# EAGLE design AUVfirstdraft3 (EAGLE 9.1.2)
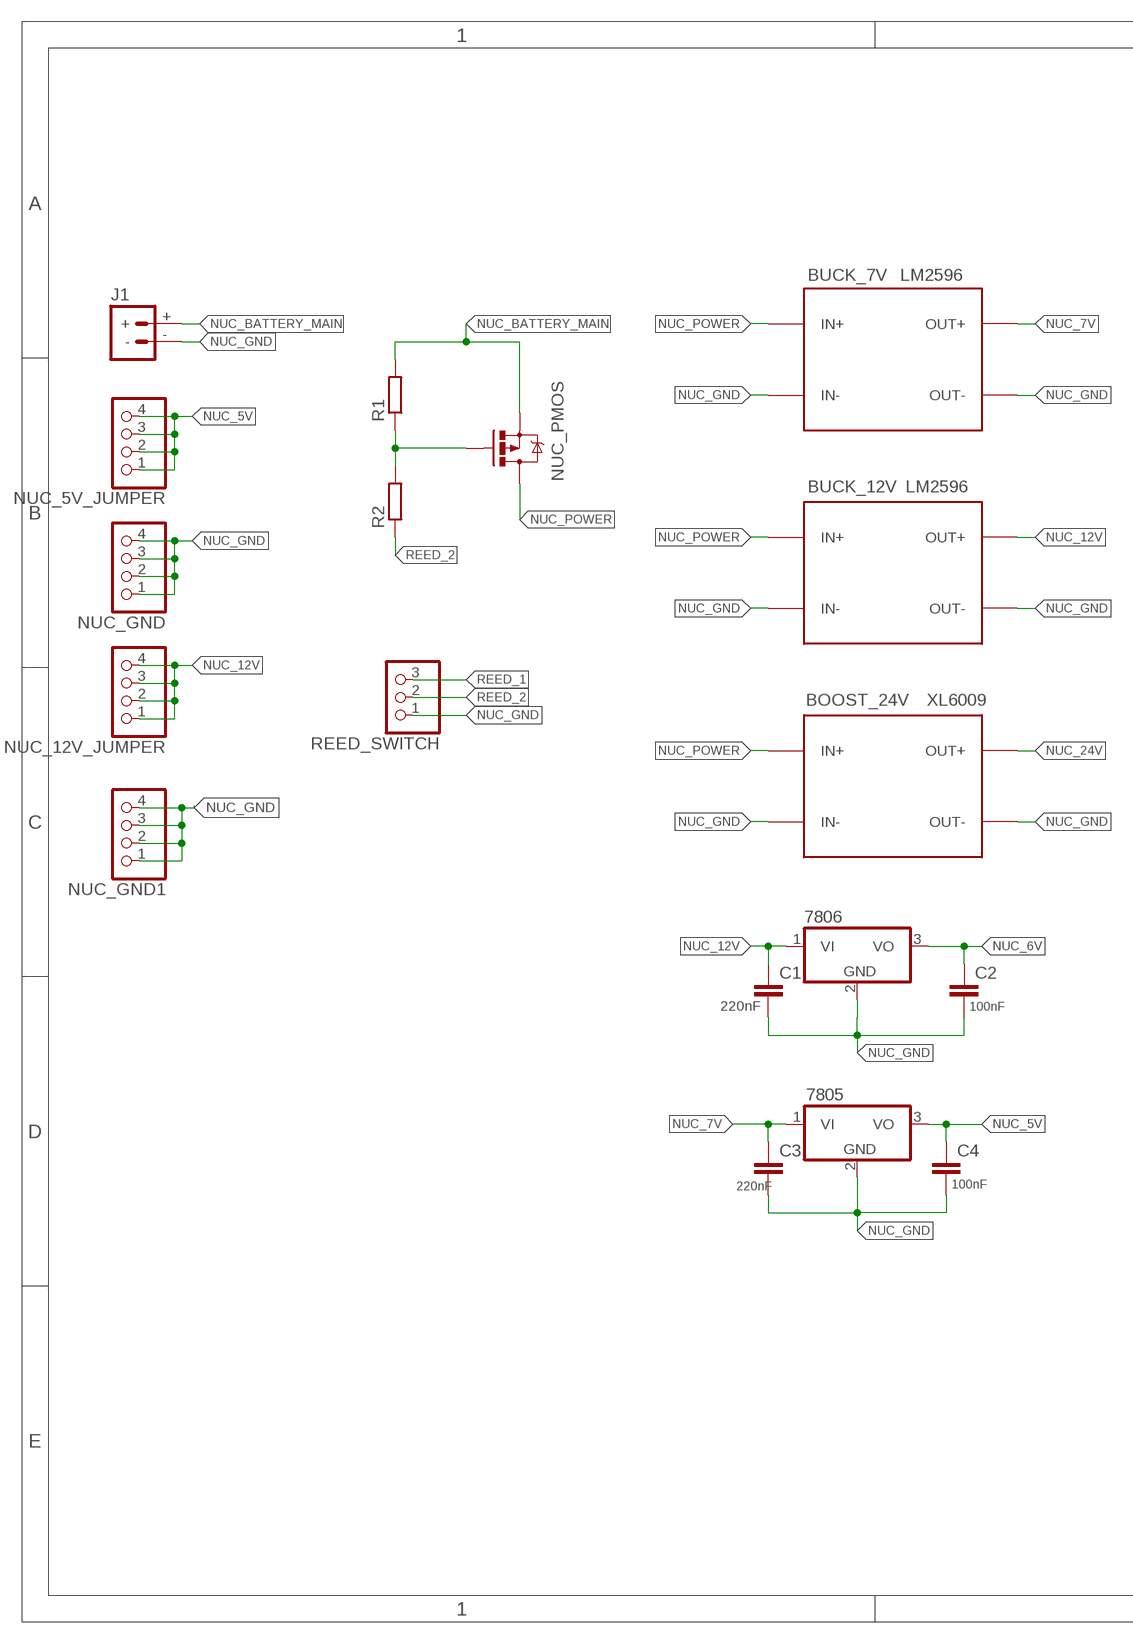
[diagram p0: schematic, sheet 1, part 1 of 3]
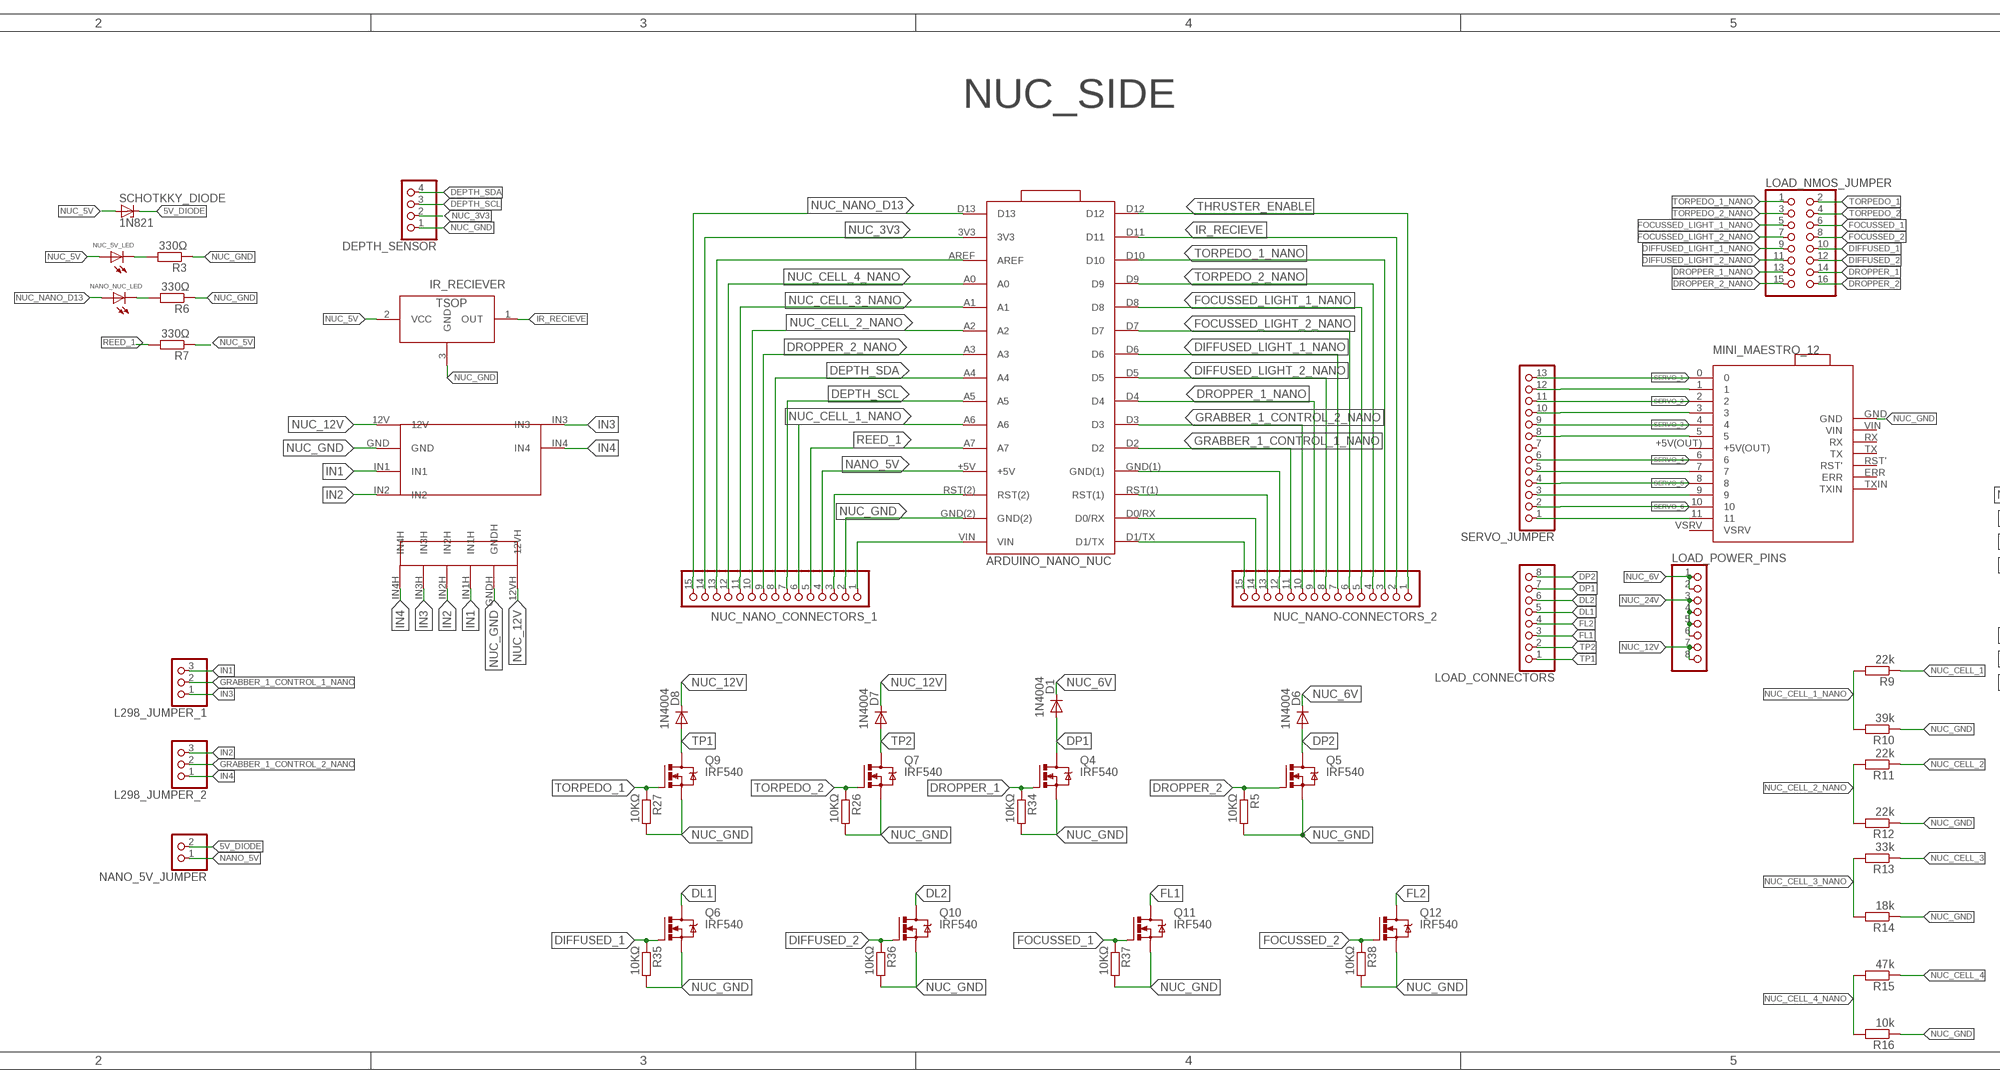
[diagram p1: schematic, sheet 1, part 2 of 3]
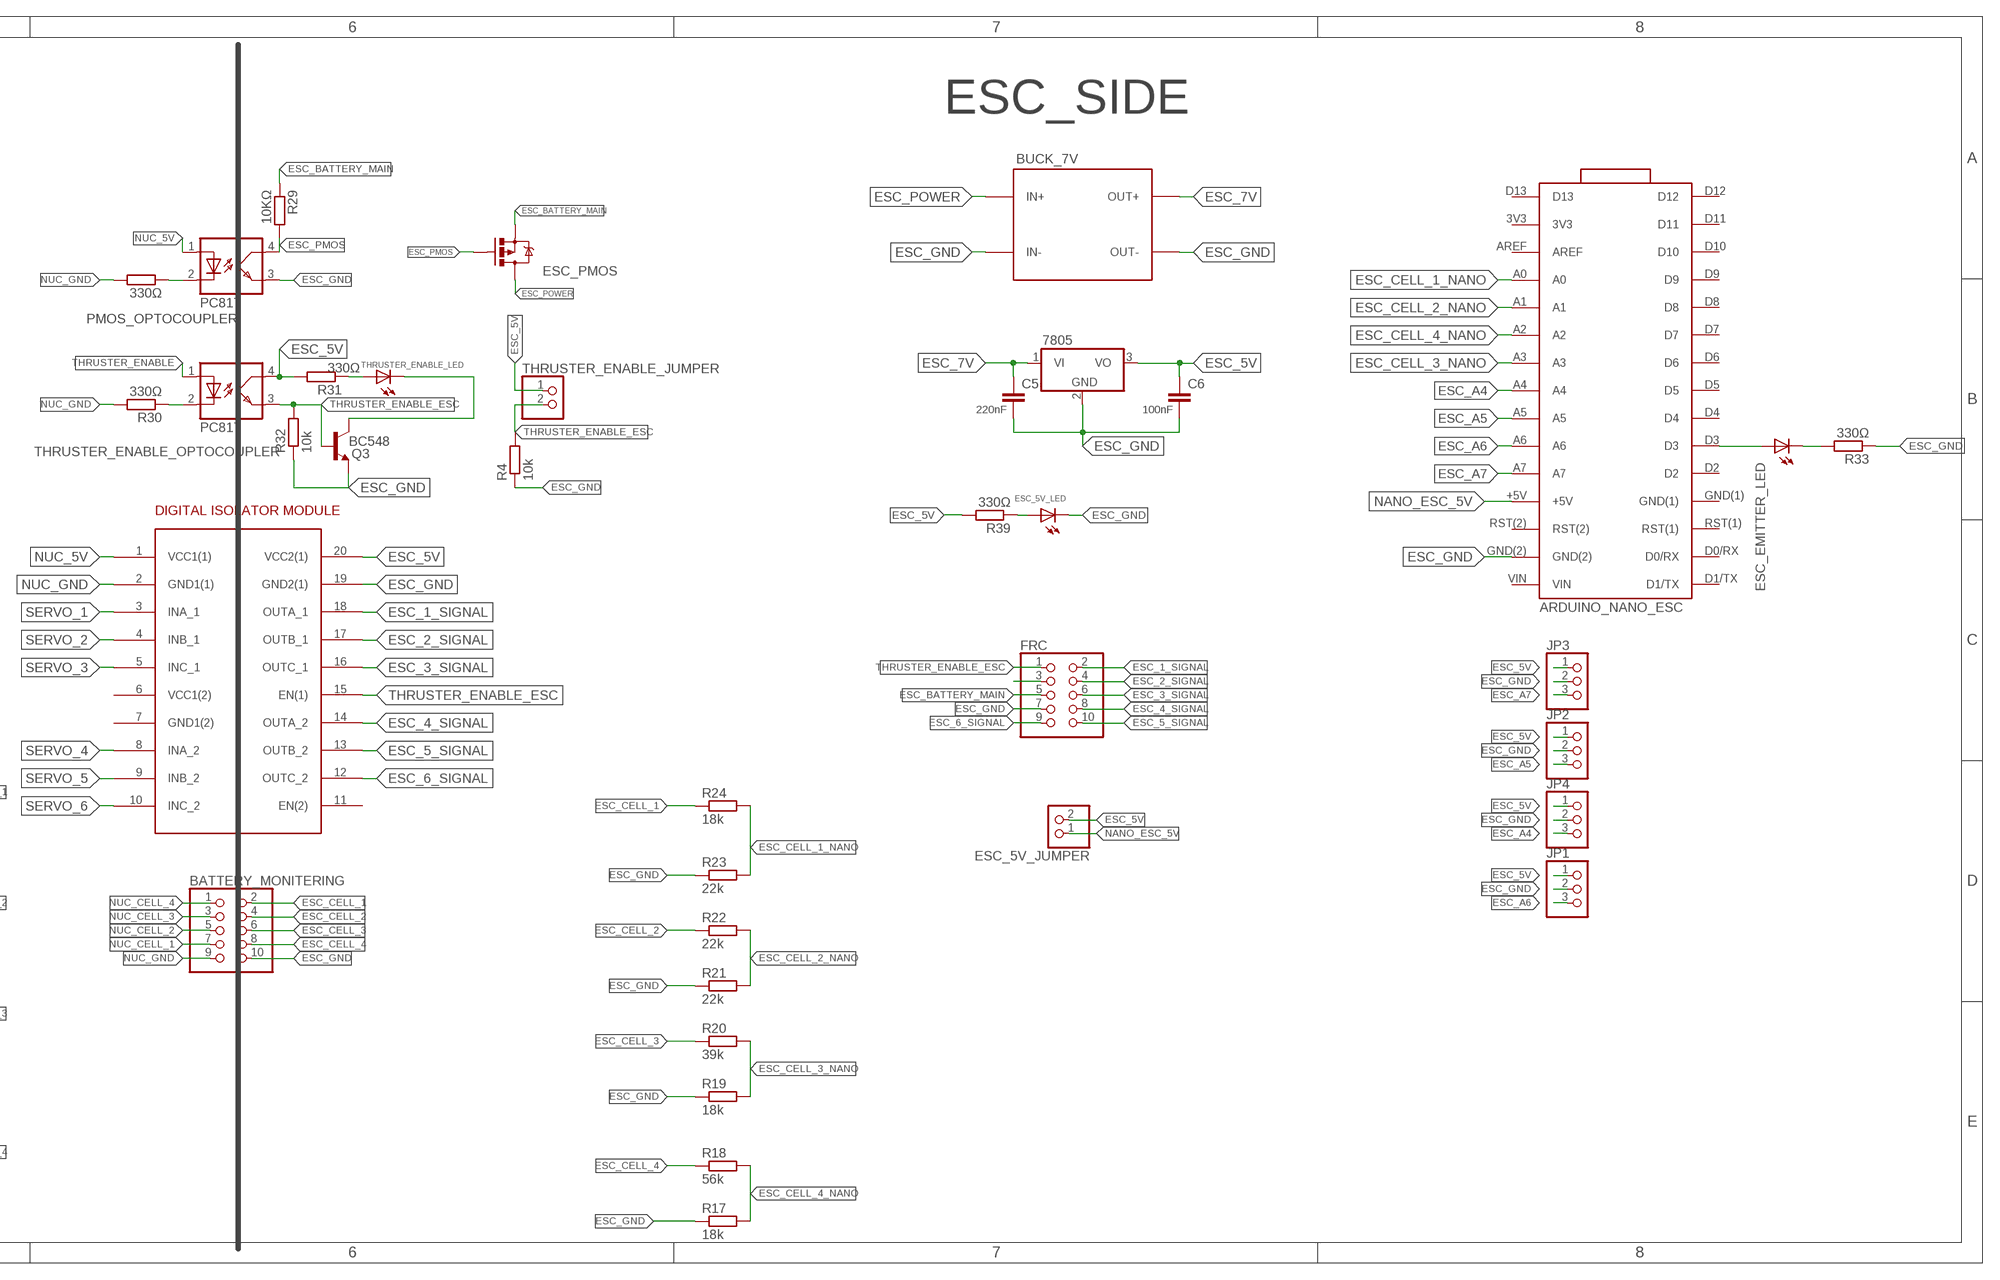
[diagram p2: schematic, sheet 1, part 3 of 3]

## Parts
330Ω  R-EU_0204/7  [0204/7]
7805_ESC  7805TV  [TO220V]
7805_NUC  7805TV  [TO220V]
7806_NUC  7805TV  [TO220V]
BATTERY_MONITERING  PINHD-2X5  [2X05]
BOOST_24V_NUC  DC-DC-STEP-DOWN-LM2596  [DC-DC-STEP-DOWN-LM2596]
BUCK_7V_ESC  DC-DC-STEP-DOWN-LM2596  [DC-DC-STEP-DOWN-LM2596]
BUCK_7V_NUC  DC-DC-STEP-DOWN-LM2596  [DC-DC-STEP-DOWN-LM2596]
BUCK_12_NUC  DC-DC-STEP-DOWN-LM2596  [DC-DC-STEP-DOWN-LM2596]
C1  220nF  C-EU025-024X044  [C025-024X044]
C2  100nF  C-EU025-024X044  [C025-024X044]
C3  220nF  C-EU025-024X044  [C025-024X044]
C4  100nF  C-EU025-024X044  [C025-024X044]
C5  220nF  C-EU025-024X044  [C025-024X044]
C6  100nF  C-EU025-024X044  [C025-024X044]
D1  1N4004  [DO41-10]
D6  1N4004  [DO41-10]
D7  1N4004  [DO41-10]
D8  1N4004  [DO41-10]
DEPTH_SENSOR  PINHD-1X4  [1X04]
ESC_5V_JUMPER  PINHD-1X2  [1X02]
ESC_5V_LED  LED3MM  [LED3MM]
ESC_EMITTER_LED  LED5MM  [LED5MM]
ESC_PMOS  MOSFET-PCHANNELFQP27P06  [TO220V]
FRC  PINHD-2X5  [2X05]
IR_RECIEVER  TSOP34X  [TSOP3XXX]
ISOLATION_CIRCUIT  DIGITAL_ISOLATOR  [DIGITAL_ISOLATOR_MODULE]
J1  BATTERY_CONN_DEANS  [DEANS]
JP1  PINHD-1X3  [1X03]
JP2  PINHD-1X3  [1X03]
JP3  PINHD-1X3  [1X03]
JP4  PINHD-1X3  [1X03]
L298_JUMPER_1  PINHD-1X3  [1X03]
L298_JUMPER_2  PINHD-1X3  [1X03]
L298_MOTOR_DRIVER  L298MODULE  [L298MODULE]
LOAD_CONNECTORS  PINHD-1X8  [1X08]
LOAD_NMOS_JUMPER  PINHD-2X8  [2X08]
LOAD_POWER_PINS  PINHD-1X8  [1X08]
NANO_5V_JUMPER  PINHD-1X2  [1X02]
NANO_NUC_LED  LED3MM  [LED3MM]
NUC_5V_JUMPER  PINHD-1X4  [1X04]
NUC_5V_LED  LED3MM  [LED3MM]
NUC_12V_JUMPER  PINHD-1X4  [1X04]
NUC_GND  PINHD-1X4  [1X04]
NUC_GND1  PINHD-1X4  [1X04]
NUC_NANO-CONNECTORS_2  PINHD-1X15  [1X15]
NUC_NANO_CONNECTORS_1  PINHD-1X15  [1X15]
NUC_PMOS  MOSFET-PCHANNELFQP27P06  [TO220V]
PMOS_OPTOCOUPLER  PC817  [DIL04]
Q3  BC548  [TO92-EBC]
Q4  IRF540  [TO220BV]
Q5  IRF540  [TO220BV]
Q6  IRF540  [TO220BV]
Q7  IRF540  [TO220BV]
Q9  IRF540  [TO220BV]
Q10  IRF540  [TO220BV]
Q11  IRF540  [TO220BV]
Q12  IRF540  [TO220BV]
R1  R-EU_0204/7  [0204/7]
R2  R-EU_0204/7  [0204/7]
R3  330Ω  R-EU_0204/7  [0204/7]
R4  10k  R-EU_0204/7  [0204/7]
R5  10KΩ  R-EU_0204/7  [0204/7]
R6  330Ω  R-EU_0204/7  [0204/7]
R7  330Ω  R-EU_0204/7  [0204/7]
R9  22k  R-EU_0204/7  [0204/7]
R10  39k  R-EU_0204/7  [0204/7]
R11  22k  R-EU_0204/7  [0204/7]
R12  22k  R-EU_0204/7  [0204/7]
R13  33k  R-EU_0204/7  [0204/7]
R14  18k  R-EU_0204/7  [0204/7]
R15  47k  R-EU_0204/7  [0204/7]
R16  10k  R-EU_0204/7  [0204/7]
R17  18k  R-EU_0204/7  [0204/7]
R18  56k  R-EU_0204/7  [0204/7]
R19  18k  R-EU_0204/7  [0204/7]
R20  39k  R-EU_0204/7  [0204/7]
R21  22k  R-EU_0204/7  [0204/7]
R22  22k  R-EU_0204/7  [0204/7]
R23  22k  R-EU_0204/7  [0204/7]
R24  18k  R-EU_0204/7  [0204/7]
R26  10KΩ  R-EU_0204/7  [0204/7]
R27  10KΩ  R-EU_0204/7  [0204/7]
R29  10KΩ  R-EU_0204/7  [0204/7]
R30  330Ω  R-EU_0204/7  [0204/7]
R31  330Ω  R-EU_0204/7  [0204/7]
R32  10k  R-EU_0204/7  [0204/7]
R33  330Ω  R-EU_0204/7  [0204/7]
R34  10KΩ  R-EU_0204/7  [0204/7]
R35  10KΩ  R-EU_0204/7  [0204/7]
R36  10KΩ  R-EU_0204/7  [0204/7]
R37  10KΩ  R-EU_0204/7  [0204/7]
R38  10KΩ  R-EU_0204/7  [0204/7]
R39  330Ω  R-EU_0204/7  [0204/7]
REED_SWITCH  PINHD-1X3  [1X03]
SCHOTKKY_DIODE  1N821  [DO35Z10]
SERVO_JUMPER  PINHD-1X13  [1X13]
THRUSTER_ENABLE_JUMPER  PINHD-1X2  [1X02]
THRUSTER_ENABLE_LED  LED3MM  [LED3MM]
THRUSTER_ENABLE_OPTOCOUPLER  PC817  [DIL04]
U$1  ARDUINO(NANO_3.0)  [ARDUINO_NANO_30PIN]
U$4  SERVO_CONTROLLER  [SERVO_CONTROLLER]
U$6  ARDUINO(NANO_3.0)  [ARDUINO_NANO_30PIN]

## Nets
5V_DIODE: NANO_5V_JUMPER.2 SCHOTKKY_DIODE.C
DEPTH_SCL: DEPTH_SENSOR.3 NUC_NANO_CONNECTORS_1.7 U$1.A5
DEPTH_SDA: DEPTH_SENSOR.4 NUC_NANO_CONNECTORS_1.8 U$1.A4
DIFFUSED_1: LOAD_NMOS_JUMPER.10 Q6.G R35.1
DIFFUSED_2: LOAD_NMOS_JUMPER.12 Q10.G R36.1
DIFFUSED_LIGHT_1_NANO: LOAD_NMOS_JUMPER.9 NUC_NANO-CONNECTORS_2.7 U$1.D6
DIFFUSED_LIGHT_2_NANO: LOAD_NMOS_JUMPER.11 NUC_NANO-CONNECTORS_2.8 U$1.D5
DL1: LOAD_CONNECTORS.5 Q6.D
DL2: LOAD_CONNECTORS.6 Q10.D
DP1: D1.A LOAD_CONNECTORS.7 Q4.D
DP2: D6.A LOAD_CONNECTORS.8 Q5.D
DROPPER_1: LOAD_NMOS_JUMPER.14 Q4.G R34.1
DROPPER_1_NANO: LOAD_NMOS_JUMPER.13 NUC_NANO-CONNECTORS_2.9 U$1.D4
DROPPER_2: LOAD_NMOS_JUMPER.16 Q5.G R5.1
DROPPER_2_NANO: LOAD_NMOS_JUMPER.15 NUC_NANO_CONNECTORS_1.9 U$1.A3
ESC_1_SIGNAL: FRC.2 ISOLATION_CIRCUIT.18(OUTA_1)
ESC_2_SIGNAL: FRC.4 ISOLATION_CIRCUIT.17(OUTB_1)
ESC_3_SIGNAL: FRC.6 ISOLATION_CIRCUIT.16(OUTC_1)
ESC_4_SIGNAL: FRC.8 ISOLATION_CIRCUIT.14(OUTA_2)
ESC_5_SIGNAL: FRC.10 ISOLATION_CIRCUIT.13(OUTB_2)
ESC_5V: 7805_ESC.3(VO) C6.1 ESC_5V_JUMPER.2 ISOLATION_CIRCUIT.20(VCC2(1)) JP1.1 JP2.1 JP3.1 JP4.1 R31.2 R39.2 THRUSTER_ENABLE_JUMPER.1 THRUSTER_ENABLE_OPTOCOUPLER.4(COL)
ESC_6_SIGNAL: FRC.9 ISOLATION_CIRCUIT.12(OUTC_2)
ESC_7V: 7805_ESC.1(VI) BUCK_7V_ESC.OUT+ C5.1
ESC_A4: JP4.3 U$6.A4
ESC_A5: JP2.3 U$6.A5
ESC_A6: JP1.3 U$6.A6
ESC_A7: JP3.3 U$6.A7
ESC_BATTERY_MAIN: ESC_PMOS.3(S) FRC.5 R29.1
ESC_CELL_1: BATTERY_MONITERING.2 R24.1
ESC_CELL_1_NANO: R23.2 R24.2 U$6.A0
ESC_CELL_2: BATTERY_MONITERING.4 R22.1
ESC_CELL_2_NANO: R21.2 R22.2 U$6.A1
ESC_CELL_3: BATTERY_MONITERING.6 R20.1
ESC_CELL_3_NANO: R19.2 R20.2 U$6.A3
ESC_CELL_4: BATTERY_MONITERING.8 R18.1
ESC_CELL_4_NANO: R17.2 R18.2 U$6.A2
ESC_GND: 7805_ESC.2(GND) BATTERY_MONITERING.10 BUCK_7V_ESC.IN- BUCK_7V_ESC.OUT- C5.2 C6.2 ESC_5V_LED.K(C) FRC.7 ISOLATION_CIRCUIT.19(GND2(1)) JP1.2 JP2.2 JP3.2 JP4.2 PMOS_OPTOCOUPLER.3(EMIT) Q3.E R4.1 R17.1 R19.1 R21.1 R23.1 R32.1 R33.1 U$6.GND(2)
ESC_PMOS: ESC_PMOS.1(G) PMOS_OPTOCOUPLER.4(COL) R29.2
ESC_POWER: BUCK_7V_ESC.IN+ ESC_PMOS.2(D)
FL1: LOAD_CONNECTORS.3 Q11.D
FL2: LOAD_CONNECTORS.4 Q12.D
FOCUSSED_1: LOAD_NMOS_JUMPER.6 Q11.G R37.1
FOCUSSED_2: LOAD_NMOS_JUMPER.8 Q12.G R38.1
FOCUSSED_LIGHT_1_NANO: LOAD_NMOS_JUMPER.5 NUC_NANO-CONNECTORS_2.5 U$1.D8
FOCUSSED_LIGHT_2_NANO: LOAD_NMOS_JUMPER.7 NUC_NANO-CONNECTORS_2.6 U$1.D7
GRABBER_1_CONTROL_1_NANO: L298_JUMPER_1.2 NUC_NANO-CONNECTORS_2.11 U$1.D2
GRABBER_1_CONTROL_2_NANO: L298_JUMPER_2.2 NUC_NANO-CONNECTORS_2.10 U$1.D3
IN1: L298_JUMPER_1.3 L298_MOTOR_DRIVER.IN1 L298_MOTOR_DRIVER.IN1H
IN2: L298_JUMPER_2.3 L298_MOTOR_DRIVER.IN2 L298_MOTOR_DRIVER.IN2H
IN3: L298_JUMPER_1.1 L298_MOTOR_DRIVER.IN3 L298_MOTOR_DRIVER.IN3H
IN4: L298_JUMPER_2.1 L298_MOTOR_DRIVER.IN4 L298_MOTOR_DRIVER.IN4H
IR_RECIEVE: IR_RECIEVER.1(OUT) NUC_NANO-CONNECTORS_2.2 U$1.D11
N$1: NUC_NANO_CONNECTORS_1.1 U$1.VIN
N$2: NANO_NUC_LED.K(C) R6.2
N$4: R31.1 THRUSTER_ENABLE_LED.A
N$5: ESC_5V_LED.A R39.1
N$6: SERVO_JUMPER.12 U$4.1
N$7: NUC_NANO_CONNECTORS_1.3 U$1.RST(2)
N$8: 330Ω.1 PMOS_OPTOCOUPLER.2(C)
N$9: SERVO_JUMPER.10 U$4.3
N$10: ESC_EMITTER_LED.A U$6.D3
N$11: SERVO_JUMPER.8 U$4.5
N$12: FRC.3
N$13: SERVO_JUMPER.5 U$4.7
N$14: R30.1 THRUSTER_ENABLE_OPTOCOUPLER.2(C)
N$15: SERVO_JUMPER.3 U$4.9
N$16: Q3.C THRUSTER_ENABLE_LED.K(C)
N$17: NUC_NANO_CONNECTORS_1.13 U$1.AREF
N$18: ESC_EMITTER_LED.K(C) R33.2
N$19: SERVO_JUMPER.1 U$4.11
N$20: NUC_NANO-CONNECTORS_2.15 U$1.D1/TX
N$21: NUC_NANO-CONNECTORS_2.14 U$1.D0/RX
N$22: NUC_NANO-CONNECTORS_2.13 U$1.RST(1)
N$23: NUC_NANO-CONNECTORS_2.12 U$1.GND(1)
N$34: NUC_PMOS.1(G) R1.1 R2.2
N$38: NUC_5V_LED.K(C) R3.2
NANO_5V: NANO_5V_JUMPER.1 NUC_NANO_CONNECTORS_1.4 U$1.+5V
NANO_ESC_5V: ESC_5V_JUMPER.1 U$6.+5V
NUC_3V3: DEPTH_SENSOR.2 NUC_NANO_CONNECTORS_1.14 U$1.3V3
NUC_5V: 7805_NUC.3(VO) C4.1 IR_RECIEVER.2(VCC) ISOLATION_CIRCUIT.1(VCC1(1)) NUC_5V_JUMPER.1 NUC_5V_JUMPER.2 NUC_5V_JUMPER.3 NUC_5V_JUMPER.4 NUC_5V_LED.A PMOS_OPTOCOUPLER.1(A) R7.1 SCHOTKKY_DIODE.A
NUC_6V: 7806_NUC.3(VO) C2.1 D1.C D6.C LOAD_POWER_PINS.1 LOAD_POWER_PINS.2
NUC_7V: 7805_NUC.1(VI) BUCK_7V_NUC.OUT+ C3.1
NUC_12V: 7806_NUC.1(VI) BUCK_12_NUC.OUT+ C1.1 D7.C D8.C L298_MOTOR_DRIVER.12V L298_MOTOR_DRIVER.12VH LOAD_POWER_PINS.7 LOAD_POWER_PINS.8 NUC_12V_JUMPER.1 NUC_12V_JUMPER.2 NUC_12V_JUMPER.3 NUC_12V_JUMPER.4
NUC_24V: BOOST_24V_NUC.OUT+ LOAD_POWER_PINS.3 LOAD_POWER_PINS.4 LOAD_POWER_PINS.5 LOAD_POWER_PINS.6
NUC_BATTERY_MAIN: J1.+ NUC_PMOS.3(S) R1.2
NUC_CELL_1: BATTERY_MONITERING.7 R9.1
NUC_CELL_1_NANO: NUC_NANO_CONNECTORS_1.6 R9.2 R10.2 U$1.A6
NUC_CELL_2: BATTERY_MONITERING.5 R11.1
NUC_CELL_2_NANO: NUC_NANO_CONNECTORS_1.10 R11.2 R12.2 U$1.A2
NUC_CELL_3: BATTERY_MONITERING.3 R13.1
NUC_CELL_3_NANO: NUC_NANO_CONNECTORS_1.11 R13.2 R14.2 U$1.A1
NUC_CELL_4: BATTERY_MONITERING.1 R15.1
NUC_CELL_4_NANO: NUC_NANO_CONNECTORS_1.12 R15.2 R16.2 U$1.A0
NUC_GND: 330Ω.2 7805_NUC.2(GND) 7806_NUC.2(GND) BATTERY_MONITERING.9 BOOST_24V_NUC.IN- BOOST_24V_NUC.OUT- BUCK_7V_NUC.IN- BUCK_7V_NUC.OUT- BUCK_12_NUC.IN- BUCK_12_NUC.OUT- C1.2 C2.2 C3.2 C4.2 DEPTH_SENSOR.1 IR_RECIEVER.3(GND) ISOLATION_CIRCUIT.2(GND1(1)) J1.- L298_MOTOR_DRIVER.GND L298_MOTOR_DRIVER.GNDH NUC_GND1.1 NUC_GND1.2 NUC_GND1.3 NUC_GND1.4 NUC_GND.1 NUC_GND.2 NUC_GND.3 NUC_GND.4 NUC_NANO_CONNECTORS_1.2 Q4.S Q5.S Q6.S Q7.S Q9.S Q10.S Q11.S Q12.S R3.1 R5.2 R6.1 R10.1 R12.1 R14.1 R16.1 R26.2 R27.2 R30.2 R34.2 R35.2 R36.2 R37.2 R38.2 REED_SWITCH.1 U$1.GND(2) U$4.GND
NUC_NANO_D13: NANO_NUC_LED.A NUC_NANO_CONNECTORS_1.15 U$1.D13
NUC_POWER: BOOST_24V_NUC.IN+ BUCK_7V_NUC.IN+ BUCK_12_NUC.IN+ NUC_PMOS.2(D)
REED_1: NUC_NANO_CONNECTORS_1.5 R7.2 REED_SWITCH.3 U$1.A7
REED_2: R2.1 REED_SWITCH.2
SERVO_1: ISOLATION_CIRCUIT.3(INA_1) SERVO_JUMPER.13 U$4.0
SERVO_2: ISOLATION_CIRCUIT.4(INB_1) SERVO_JUMPER.11 U$4.2
SERVO_3: ISOLATION_CIRCUIT.5(INC_1) SERVO_JUMPER.9 U$4.4
SERVO_4: ISOLATION_CIRCUIT.8(INA_2) SERVO_JUMPER.6 U$4.6
SERVO_5: ISOLATION_CIRCUIT.9(INB_2) SERVO_JUMPER.4 U$4.8
SERVO_6: ISOLATION_CIRCUIT.10(INC_2) SERVO_JUMPER.2 U$4.10
THRUSTER_ENABLE: NUC_NANO-CONNECTORS_2.1 THRUSTER_ENABLE_OPTOCOUPLER.1(A) U$1.D12
THRUSTER_ENABLE_ESC: FRC.1 ISOLATION_CIRCUIT.15(EN(1)) Q3.B R4.2 R32.2 THRUSTER_ENABLE_JUMPER.2 THRUSTER_ENABLE_OPTOCOUPLER.3(EMIT)
TORPEDO_1: LOAD_NMOS_JUMPER.2 Q9.G R27.1
TORPEDO_1_NANO: LOAD_NMOS_JUMPER.1 NUC_NANO-CONNECTORS_2.3 U$1.D10
TORPEDO_2: LOAD_NMOS_JUMPER.4 Q7.G R26.1
TORPEDO_2_NANO: LOAD_NMOS_JUMPER.3 NUC_NANO-CONNECTORS_2.4 U$1.D9
TP1: D8.A LOAD_CONNECTORS.1 Q9.D
TP2: D7.A LOAD_CONNECTORS.2 Q7.D
Unconnected: ISOLATION_CIRCUIT.6(VCC1(2)) ISOLATION_CIRCUIT.7(GND1(2)) ISOLATION_CIRCUIT.11(EN(2)) SERVO_JUMPER.7 U$4.+5V(OUT) U$4.ERR U$4.RST' U$4.RX U$4.TX U$4.TXIN U$4.VIN U$4.VSRV U$6.3V3 U$6.AREF U$6.D0/RX U$6.D1/TX U$6.D2 U$6.D4 U$6.D5 U$6.D6 U$6.D7 U$6.D8 U$6.D9 U$6.D10 U$6.D11 U$6.D12 U$6.D13 U$6.GND(1) U$6.RST(1) U$6.RST(2) U$6.VIN

## Notes on the sheet
- NUC_SIDE | ESC_SIDE
- BUCK_7V
- BUCK_7V | LM2596
- 7805
- BUCK_12V | LM2596
- MINI_MAESTRO_12
- BOOST_24V | XL6009
- ARDUINO_NANO_ESC
- ARDUINO_NANO_NUC
- 7806
- 7805

## Library data of the parts
330Ω R1-R7 R9-R24 R26 R27 R29-R39 = resistor:R-EU_: RESISTOR, European symbol
7805_ESC 7805_NUC 7806_NUC = linear:78*: Positive VOLTAGE REGULATOR Source: http://cache.national.com/ds/LM/LM78L05.pdf http://www.fairchildsemi.com/ds/LM/LM7805.pdf
BATTERY_MONITERING FRC = pinhead:PINHD-2X5: PIN HEADER
BOOST_24V_NUC BUCK_7V_ESC BUCK_7V_NUC BUCK_12_NUC = diy-modules:DC-DC-STEP-DOWN-LM2596: DC/DC Step-Down Regulator based on LM2596-ADJ chip LM2596 datasheet available here: http://www.ti.com/lit/ds/symlink/lm2596.pdf Click here to find device on ebay.com <http://www.ebay.com/sch/lm2596+power+regulator>
C1-C6 = rcl:C-EU: CAPACITOR, European symbol
D1 D6-D8 = adafruit:1N4004: DIODE General purpose 1N400x type rectifier (With bigger pads) http://www.ladyada.net/library/pcb/eaglelibrary.html
DEPTH_SENSOR NUC_5V_JUMPER NUC_12V_JUMPER NUC_GND NUC_GND1 = pinhead:PINHD-1X4: PIN HEADER
ESC_5V_JUMPER NANO_5V_JUMPER THRUSTER_ENABLE_JUMPER = pinhead:PINHD-1X2: PIN HEADER
ESC_5V_LED ESC_EMITTER_LED NANO_NUC_LED NUC_5V_LED THRUSTER_ENABLE_LED = adafruit:LED: LED OSRAM: - CHIPLED LG R971, LG N971, LY N971, LG Q971, LY Q971, LO R971, LY R971 LH N974, LH R974 LS Q976, LO Q976, LY Q976 LO Q996 - Hyper CHIPLED LW Q18S LB Q993, LB Q99A, LB R99A - SideLED LS A670, LO A670, LY A670, LG A670, LP A670 LB A673, LV A673, LT A673, LW A673 LH A674 LY A675 LS A676, LA A676, LO A676, LY A676, LW A676 LS A679, LY A679, LG A679 - Hyper Micro SIDELED® LS Y876, LA Y876, LO Y876, LY Y876 LT Y87S - SmartLED LW L88C, LW L88S LB L89C, LB L89S, LG L890 LS L89K, LO L89K, LY L89K LS L896, LA L896, LO L896, LY L896 - TOPLED LS T670, LO T670, LY T670, LG T670, LP T670 LSG T670, LSP T670, LSY T670, LOP T670, LYG T670 LG T671, LOG T671, LSG T671 LB T673, LV T673, LT T673, LW T673 LH T674 LS T676, LA T676, LO T676, LY T676, LB T676, LH T676, LSB T676, LW T676 LB T67C, LV T67C, LT T67C, LS T67K, LO T67K, LY T67K, LW E67C LS E67B, LA E67B, LO E67B, LY E67B, LB E67C, LV E67C, LT E67C LW T67C LS T679, LY T679, LG T679 LS T770, LO T770, LY T770, LG T770, LP T770 LB T773, LV T773, LT T773, LW T773 LH T774 LS E675, LA E675, LY E675, LS T675 LS T776, LA T776, LO T776, LY T776, LB T776 LHGB T686 LT T68C, LB T68C - Hyper Mini TOPLED® LB M676 - Mini TOPLED Santana® LG M470 LS M47K, LO M47K, LY M47K Source: http://www.osram.convergy.de/
ESC_PMOS NUC_PMOS = SparkFun-DiscreteSemi:MOSFET-PCHANNEL: Generic PMOSFET IRLML2244 - TRANS-11153 (SOT-23 -20V -4.3A) (1.Gate 2.Source 3.Drain) FQP27P06 - COM-10349 <http://www.sparkfun.com/products/10349> (TO-220 -60V -27A) (1.Gate 2.Source 3.Drain)
IR_RECIEVER = CEDT_JANUARY_2015_v5:TSOP34X: Vishay IR Reciever Product Page <http://www.vishay.com/product?docid=82489> Family -TSOP34XX Part by : Rohit Gupta
ISOLATION_CIRCUIT = ISO7330C DIGITAL ISOLATOR MODULE:DIGITAL_ISOLATOR
J1 = SparkFun-Connectors:BATTERY_CONN: Battery Connectors Various footprints for battery connections SparkFun Products: Deans Connector -M/F Pair <https://www.sparkfun.com/products/11864>; SF_ID: PRT-11864
JP1-JP4 L298_JUMPER_1 L298_JUMPER_2 REED_SWITCH = pinhead:PINHD-1X3: PIN HEADER
L298_MOTOR_DRIVER = l298module:L298MODULE
LOAD_CONNECTORS LOAD_POWER_PINS = pinhead:PINHD-1X8: PIN HEADER
LOAD_NMOS_JUMPER = pinhead:PINHD-2X8: PIN HEADER
NUC_NANO-CONNECTORS_2 NUC_NANO_CONNECTORS_1 = pinhead:PINHD-1X15: PIN HEADER
PMOS_OPTOCOUPLER THRUSTER_ENABLE_OPTOCOUPLER = optocoupler:PC817: SHARP OPTO COUPLER; MPN: PC817X4J000F; OC_FARNELL: 9707727; OC_NEWARK: 97K7059
Q3 = transistor-npn:BC548*: NPN Transistor
Q4-Q7 Q9-Q12 = transistor-power:IRF540: HEXFET Power MOSFET
SCHOTKKY_DIODE = diode:1N821: Reference DIODE temperature compensated, 6,2 V
SERVO_JUMPER = pinhead:PINHD-1X13: PIN HEADER
U$1 U$6 = Arduino_Nano_3:ARDUINO(NANO_3.0)
U$4 = Servo Controller:SERVO_CONTROLLER

## Board
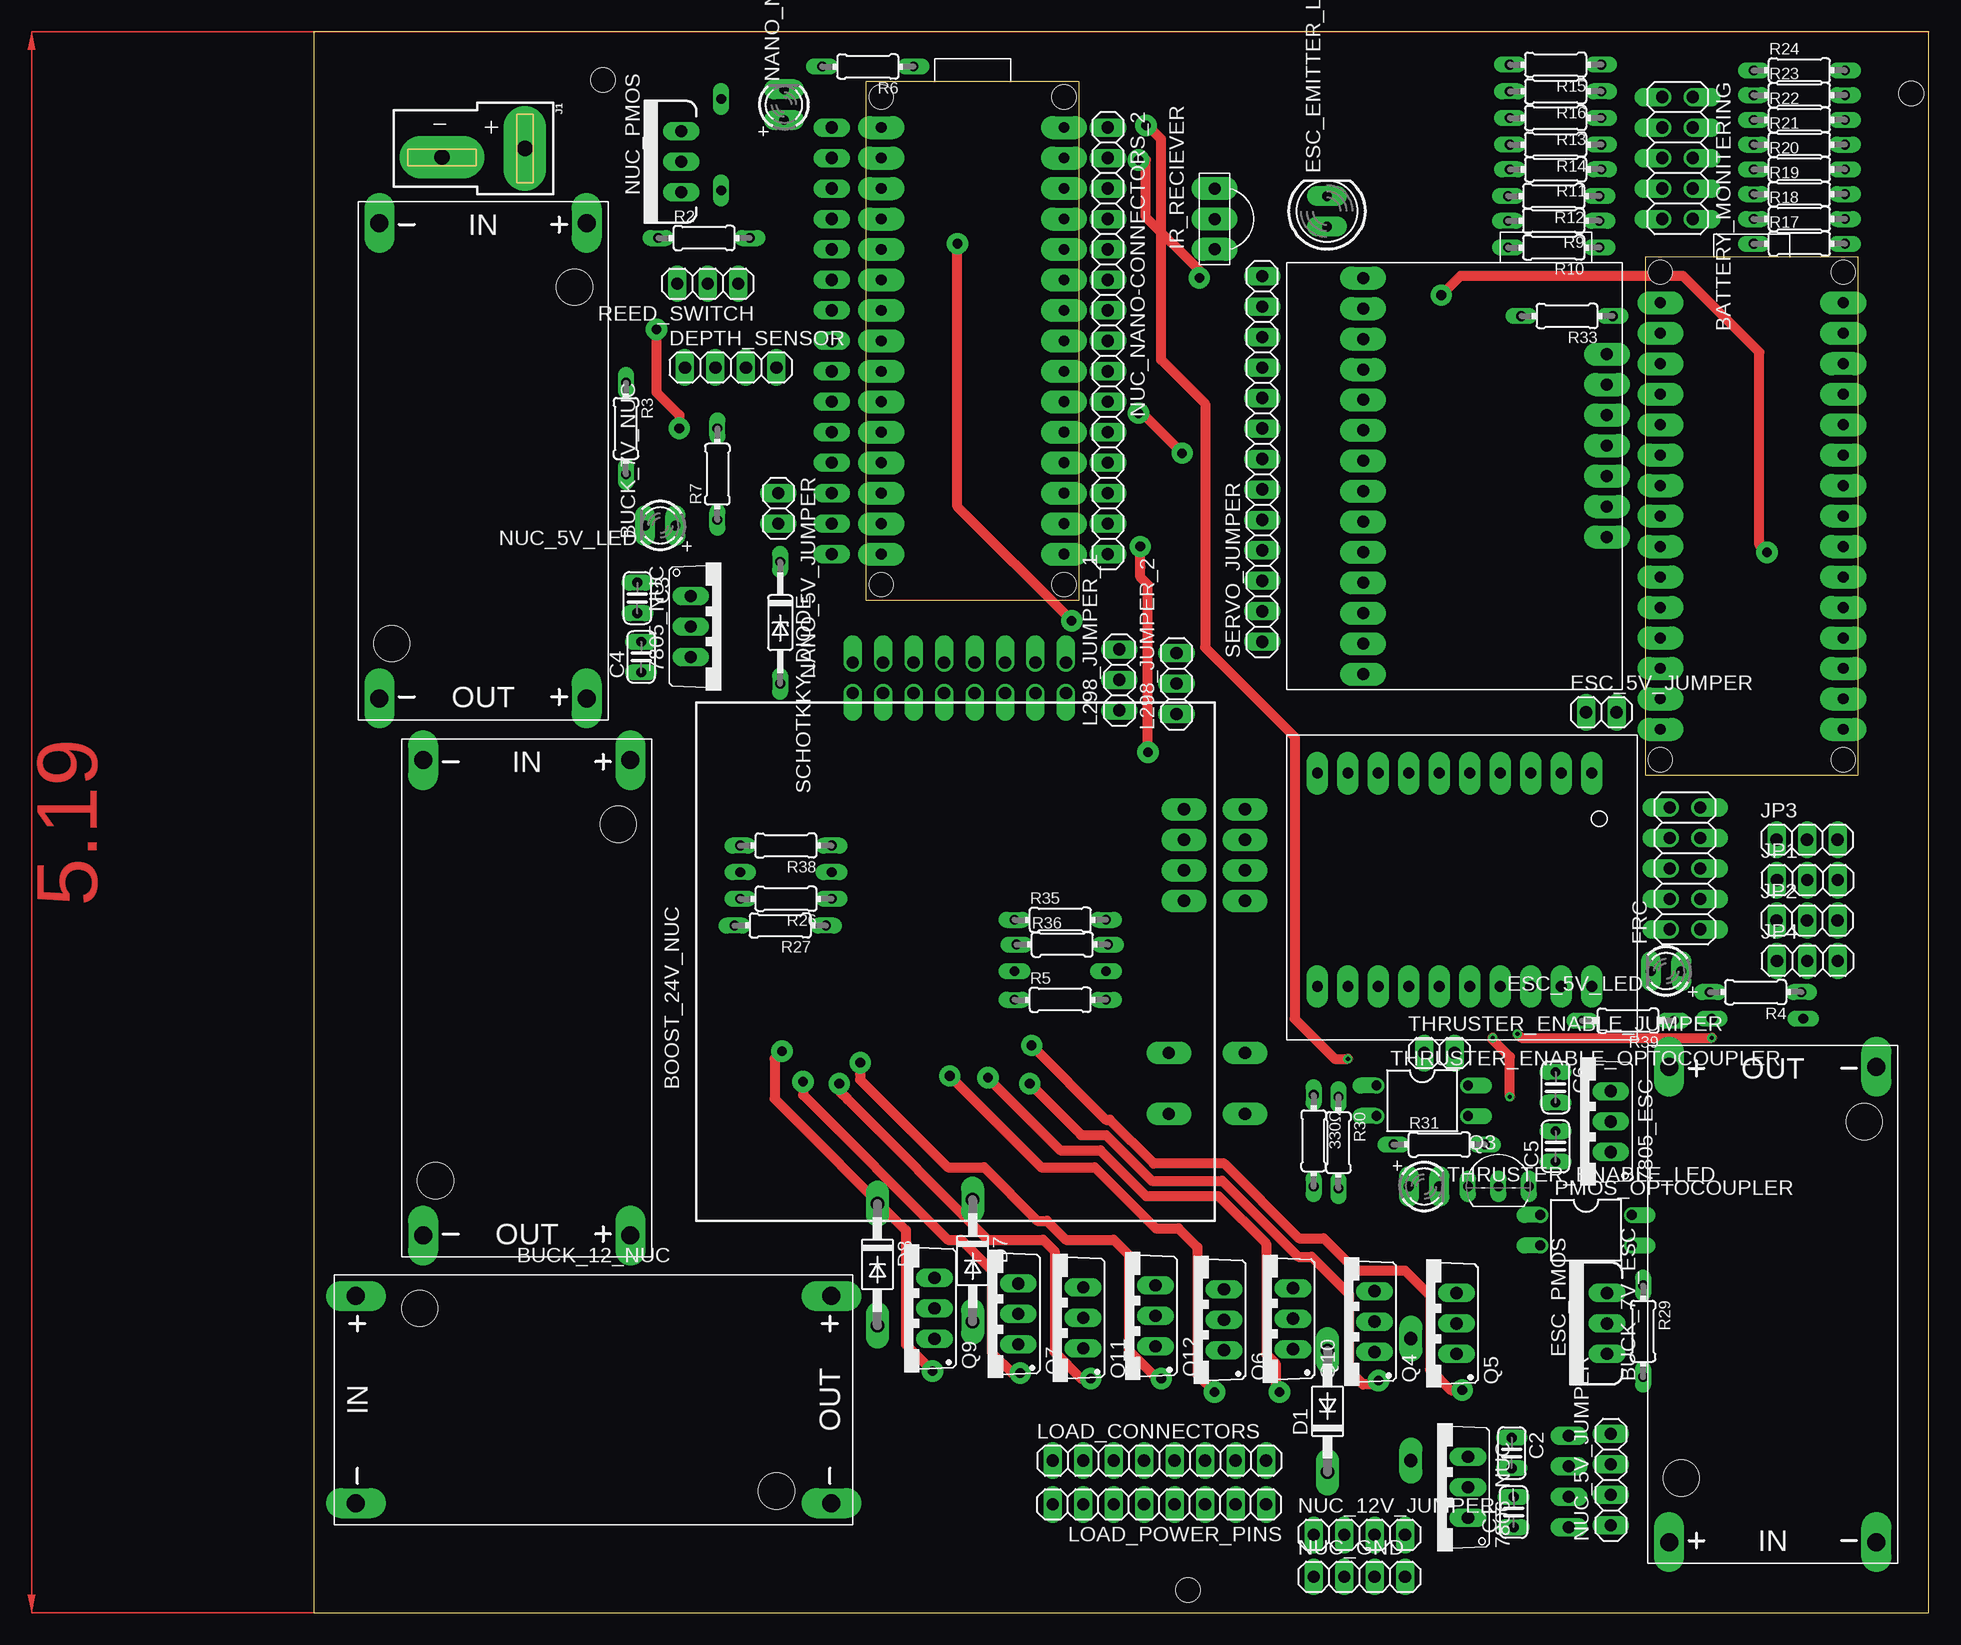
[diagram p3: board, top side]
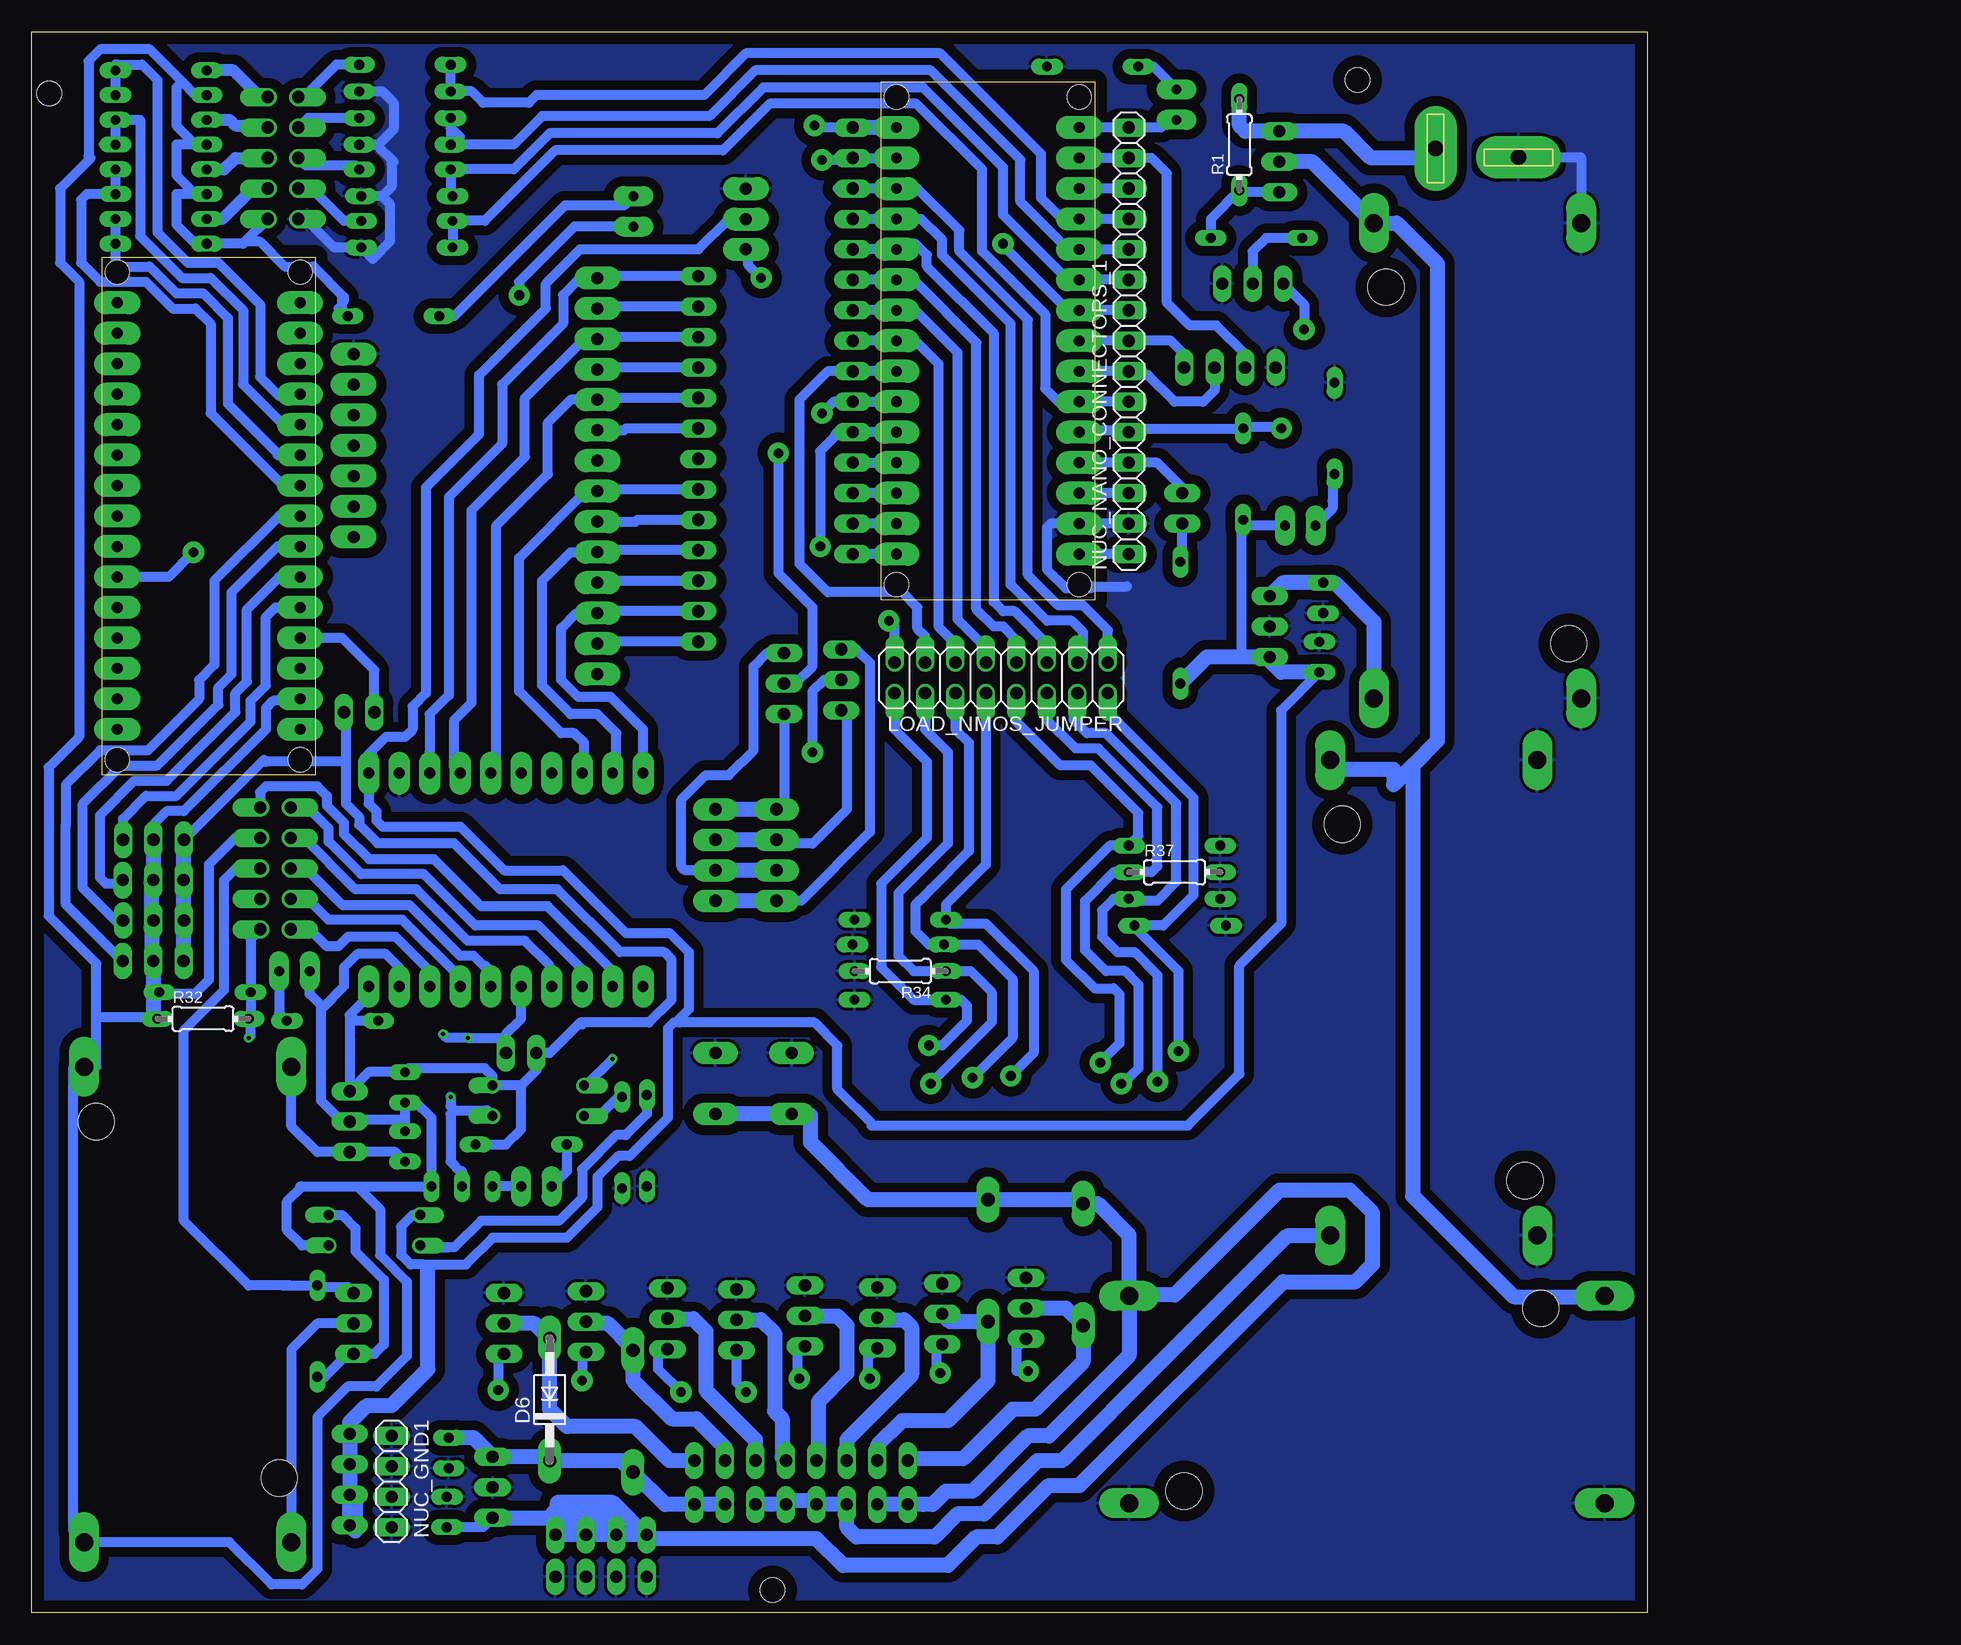
[diagram p4: board, bottom side, seen from below]

Size 134.62 x 131.83 mm. Coordinates in mm from the lower left corner, seen from the top.
Outline: 0,0 134.62,0 134.62,131.83 0,131.83 0,0
Copper layers (1*16): Top 0.035mm / dielectric 1.5mm / Bottom 0.035mm
Design rules "default *": minimum track width 6mil, minimum drill 0.35mm, track to track 12mil, track to pad 12mil, pad to pad 12mil, via to via 12mil, smd to smd 12mil, copper to edge 40mil, drill to drill 6mil, minimum pad ring 10mil, minimum via ring 8mil, stop-mask expansion 4mil, vias tented up to drill 0mil, thermal gap 10mil
Holes 2.03 mm at 24.13,127.79 133.15,126.65 72.87,1.9

### Footprints (pad centres in the part's own frame; a part is rotated, then mirrored left to right if it is on the bottom)
0204/7 = drill 0.813 long: 1 -3.81,0; 2 3.81,0
TO220V = drill 1.016 long: 1 -2.54,-2.54; 2 0,-2.54; 3 2.54,-2.54
2X05 = drill 1.016 offset: 1 -5.08,-1.27; 2 -5.08,1.27; 3 -2.54,-1.27; 4 -2.54,1.27; 5 0,-1.27; 6 0,1.27; 7 2.54,-1.27; 8 2.54,1.27; 9 5.08,-1.27; 10 5.08,1.27
DC-DC-STEP-DOWN-LM2596 = drill 1.5 pad 2.5 long: IN+ -19.812,8.636; IN- -19.812,-8.636; OUT+ 19.812,8.636; OUT- 19.812,-8.636 | hole 3: -14.478,7.62; 15.24,-7.62
C025-024X044 = drill 0.813 long: 1 -1.27,0; 2 1.27,0
DO41-10 = drill 1.118 pad 1.93 long: A 5.08,0; C -5.08,0
1X04 = drill 1.016 long: 1 -3.81,0; 2 -1.27,0; 3 1.27,0; 4 3.81,0
1X02 = drill 1.016 long: 1 -1.27,0; 2 1.27,0
LED3MM = drill 0.813 pad 1.676 long: A -1.27,0; K 1.27,0
LED5MM = drill 0.813 pad 1.676 long: A -1.27,0; K 1.27,0
TO220V' = drill 1.016 long: 1 -2.54,0; 2 0,0; 3 2.54,0
TSOP3XXX = drill 1 pad 1.93 long: 1 -2.54,0; 2 0,0; 3 2.54,0
DIGITAL_ISOLATOR_MODULE = drill 0.9 pad 1.778 long: 1 2.54,25.4; 2 2.54,22.86; 3 2.54,20.32; 4 2.54,17.78; 5 2.54,15.24; 6 2.54,12.7; 7 2.54,10.16; 8 2.54,7.62; 9 2.54,5.08; 10 2.54,2.54; 11 20.32,2.54; 12 20.32,5.08; 13 20.32,7.62; 14 20.32,10.16; 15 20.32,12.7; 16 20.32,15.24; 17 20.32,17.78; 18 20.32,20.32; 19 20.32,22.86; 20 20.32,25.4
DEANS = drill 1.27 pad 3.556 long: + 0,0; - 0.737,-6.921
1X03 = drill 1.016 long: 1 -2.54,0; 2 0,0; 3 2.54,0
L298MODULE = drill 1.016 pad 1.88 long: 12V 8.89,3.81; 12VH 8.89,-2.54; GND 13.97,3.81; GNDH 13.97,-2.54; IN1 26.67,2.54; IN1H 26.67,-2.54; IN2 29.21,2.54; IN2H 29.21,-2.54; IN3 31.75,2.54; IN3H 31.75,-2.54; IN4 34.29,2.54; IN4H 34.29,-2.54
1X08 = drill 1.016 long: 1 -8.89,0; 2 -6.35,0; 3 -3.81,0; 4 -1.27,0; 5 1.27,0; 6 3.81,0; 7 6.35,0; 8 8.89,0
2X08 = drill 1.016 offset: 1 -8.89,-1.27; 2 -8.89,1.27; 3 -6.35,-1.27; 4 -6.35,1.27; 5 -3.81,-1.27; 6 -3.81,1.27; 7 -1.27,-1.27; 8 -1.27,1.27; 9 1.27,-1.27; 10 1.27,1.27; 11 3.81,-1.27; 12 3.81,1.27; 13 6.35,-1.27; 14 6.35,1.27; 15 8.89,-1.27; 16 8.89,1.27
1X15 = drill 1.016 long: 1 -17.78,0; 2 -15.24,0; 3 -12.7,0; 4 -10.16,0; 5 -7.62,0; 6 -5.08,0; 7 -2.54,0; 8 0,0; 9 2.54,0; 10 5.08,0; 11 7.62,0; 12 10.16,0; 13 12.7,0; 14 15.24,0; 15 17.78,0
DIL04 = drill 0.813 offset: 1 -1.27,-3.81; 2 1.27,-3.81; 3 1.27,3.81; 4 -1.27,3.81
TO92-EBC = drill 0.813 long: B 0,-1.27; C -2.54,-1.27; E 2.54,-1.27
TO220BV = drill 1.016 long: D 0,-2.54; G -2.54,-2.54; S 2.54,-2.54
DO35Z10 = drill 0.813 long: A 5.08,0; C -5.08,0
1X13 = drill 1.016 long: 1 -15.24,0; 2 -12.7,0; 3 -10.16,0; 4 -7.62,0; 5 -5.08,0; 6 -2.54,0; 7 0,0; 8 2.54,0; 9 5.08,0; 10 7.62,0; 11 10.16,0; 12 12.7,0; 13 15.24,0
ARDUINO_NANO_30PIN = drill 0.9 pad 1.93 long: 3V3 16.51,6.35; +5V 16.51,31.75; A0 16.51,11.43; A1 16.51,13.97; A2 16.51,16.51; A3 16.51,19.05; A4 16.51,21.59; A5 16.51,24.13; A6 16.51,26.67; A7 16.51,29.21; AREF 16.51,8.89; D0/RX 1.27,36.83; D1/TX 1.27,39.37; D2 1.27,29.21; D3 1.27,26.67; D4 1.27,24.13; D5 1.27,21.59; D6 1.27,19.05; D7 1.27,16.51; D8 1.27,13.97; D9 1.27,11.43; D10 1.27,8.89; D11 1.27,6.35; D12 1.27,3.81; D13 16.51,3.81; GND(1) 1.27,31.75; GND(2) 16.51,36.83; RST(1) 1.27,34.29; RST(2) 16.51,34.29; VIN 16.51,39.37 | hole 2: 1.27,41.91; 16.51,41.91; 16.51,1.27; 1.27,1.27
SERVO_CONTROLLER = drill 1 pad 1.93 long: 0 6.35,34.29; 1 6.35,31.75; 2 6.35,29.21; 3 6.35,26.67; 4 6.35,24.13; 5 6.35,21.59; 6 6.35,16.51; 7 6.35,13.97; 8 6.35,11.43; 9 6.35,8.89; 10 6.35,6.35; 11 6.35,3.81; +5V(OUT) 6.35,19.05; ERR 26.67,15.24; GND 26.67,27.94; RST' 26.67,17.78; RX 26.67,22.86; TX 26.67,20.32; TXIN 26.67,12.7; VIN 26.67,25.4; VSRV 6.35,1.27

### Placement (x,y rotation side)
330Ω  83.34,39.37 270 top
7805_ESC  105.57,40.96 90 top
7805_NUC  33.97,82.23 270 top
7806_NUC  93.66,10.48 90 top
BATTERY_MONITERING  113.67,121.29 270 top
BOOST_24V_NUC  17.78,51.28 270 top
BUCK_7V_ESC  121.6,25.72 90 top
BUCK_7V_NUC  14.13,96.04 270 top
BUCK_12_NUC  23.34,17.78 0 top
C1  100.01,8.41 90 top
C2  99.85,13.34 270 top
C3  26.99,84.61 270 top
C4  27.3,79.69 90 top
C5  103.5,38.89 90 top
C6  103.5,43.81 270 top
D1  84.5,16.81 90 top
D6  91.44,17.78 90 bottom
D7  54.93,29.37 270 top
D8  46.99,29.05 270 top
DEPTH_SENSOR  34.77,103.82 0 top
ESC_5V_JUMPER  107.31,75.09 0 top
ESC_5V_LED  112.71,53.5 180 top
ESC_EMITTER_LED  84.46,116.84 90 top
ESC_PMOS  MOSFET-PCHANNELFQP27P06  [TO220V']  107.79,24.13 90 top
FRC  114.3,62.07 90 top
IR_RECIEVER  75.09,116.2 90 top
ISOLATION_CIRCUIT  81.12,72.55 270 top
J1  17.62,122.08 270 top
JP1  124.49,61.09 0 top
JP2  124.46,57.73 0 top
JP3  124.46,64.46 0 top
JP4  124.49,54.35 0 top
L298_JUMPER_1  67.15,77.79 90 top
L298_JUMPER_2  71.91,77.47 90 top
L298_MOTOR_DRIVER  75.09,32.7 90 top
LOAD_CONNECTORS  70.49,12.7 0 top
LOAD_NMOS_JUMPER  53.82,77.95 180 bottom
LOAD_POWER_PINS  70.49,9.05 180 top
NANO_5V_JUMPER  38.73,92.08 270 top
NANO_NUC_LED  39.21,125.73 90 top
NUC_5V_JUMPER  108.11,11.11 90 top
NUC_5V_LED  28.89,90.65 180 top
NUC_12V_JUMPER  87.15,6.51 0 top
NUC_GND  87.15,3.02 0 top
NUC_GND1  104.62,10.95 270 bottom
NUC_NANO-CONNECTORS_2  66.2,106.05 270 top
NUC_NANO_CONNECTORS_1  43.18,106.05 90 bottom
NUC_PMOS  MOSFET-PCHANNELFQP27P06  [TO220V']  30.64,120.97 90 top
PMOS_OPTOCOUPLER  106.04,31.91 270 top
Q3  98.74,36.83 0 top
Q4  85.88,24.29 90 top
Q5  92.71,24.13 90 top
Q6  73.34,24.45 90 top
Q7  56.2,24.92 90 top
Q9  49.21,25.4 90 top
Q10  79.09,24.53 90 top
Q11  61.6,24.61 90 top
Q12  67.63,24.77 90 top
R1  33.97,122.4 90 bottom
R2  32.54,114.62 0 top
R3  26.03,98.74 270 top
R4  120.17,51.75 180 top
R5  62.23,51.12 0 top
R6  46.2,128.9 180 top
R7  33.66,94.93 90 top
R9  103.35,116.05 180 top
R10  103.35,113.82 180 top
R11  103.5,120.33 180 top
R12  103.35,118.11 180 top
R13  103.5,124.62 180 top
R14  103.5,122.4 180 top
R15  103.5,129.06 180 top
R16  103.5,126.84 180 top
R17  123.83,114.14 0 top
R18  123.83,116.2 0 top
R19  123.83,118.27 0 top
R20  123.83,120.33 0 top
R21  123.83,122.4 0 top
R22  123.83,124.46 0 top
R23  123.83,126.52 0 top
R24  123.83,128.59 0 top
R26  39.37,59.53 180 top
R27  38.89,57.31 180 top
R29  110.81,23.49 270 top
R30  85.41,39.21 270 top
R31  93.82,39.05 0 top
R32  120.33,49.53 0 bottom
R33  104.46,108.11 180 top
R34  62.23,53.5 180 bottom
R35  62.23,57.78 0 top
R36  62.39,55.72 0 top
R37  39.37,61.75 0 bottom
R38  39.37,63.98 180 top
R39  109.54,49.37 180 top
REED_SWITCH  32.86,110.81 180 top
SCHOTKKY_DIODE  38.89,82.55 270 top
SERVO_JUMPER  79.06,96.2 90 top
THRUSTER_ENABLE_JUMPER  93.82,46.67 0 top
THRUSTER_ENABLE_LED  92.55,35.56 0 top
THRUSTER_ENABLE_OPTOCOUPLER  92.39,42.7 270 top
U$1  63.82,127.64 180 top
U$4  81.12,76.99 0 top
U$6  128.75,113.03 180 top

### Tracks (layer width: path | path; a pad name or v marks a point on that pad's centre or on a via)
5V_DIODE
  Bottom 0.813: NANO_5V_JUMPER.2 38.73,88.42 38.89,88.27 SCHOTKKY_DIODE.C
DEPTH_SCL
  Bottom 0.813: 43.02,103.66 NUC_NANO_CONNECTORS_1.7 | NUC_NANO_CONNECTORS_1.7 U$1.A5 | DEPTH_SENSOR.3 36.04,101.92 36.99,100.97 39.37,100.97 41.59,103.19 42.86,103.19 NUC_NANO_CONNECTORS_1.7
DEPTH_SDA
  Bottom 0.813: DEPTH_SENSOR.4 38.58,104.93 39.69,106.05 NUC_NANO_CONNECTORS_1.8 U$1.A4
DIFFUSED_1  (via drill 0.8 pad 1.78)
  Top 0.813: v53.02,44.77 60.64,37.15 65.09,37.15 70.17,32.07 72.07,32.07 73.66,30.48 73.66,19.84 v75.09,18.41
  Bottom 0.813: v53.02,44.77 51.12,46.67 51.12,53.5 55.09,57.47 58.1,57.47 R35.1 58.42,59.05 55.09,62.39 LOAD_NMOS_JUMPER.10 | Q6.G 75.88,19.21 v75.09,18.41
DIFFUSED_2  (via drill 0.8 pad 1.78)
  Top 0.813: v56.2,44.61 62.23,38.58 65.56,38.58 69.37,34.77 75.41,34.77 79.38,30.8 79.38,21.59 80.17,20.8 80.17,18.73 v80.49,18.41
  Bottom 0.813: v56.2,44.61 52.86,47.94 52.86,52.86 55.72,55.72 R36.1 59.85,55.72 60.96,56.83 60.96,59.05 60.17,59.85 59.69,60.33 56.51,63.5 56.51,72.55 57.63,73.66 LOAD_NMOS_JUMPER.12 | Q10.G 81.79,21.99 82.42,21.36 82.42,20.35 v80.49,18.41
DIFFUSED_LIGHT_1_NANO
  Bottom 0.813: NUC_NANO-CONNECTORS_2.7 U$1.D6 60.96,108.58 57.47,105.09 57.47,82.87 55.09,80.49 LOAD_NMOS_JUMPER.9
DIFFUSED_LIGHT_2_NANO
  Bottom 0.813: NUC_NANO-CONNECTORS_2.8 U$1.D5 60.96,106.05 59.05,104.14 59.05,82.23 57.63,80.8 LOAD_NMOS_JUMPER.11
DL1
  Bottom 1.27: Q6.D 73.82,24.45 72.71,23.34 72.71,16.83 72.07,16.19 72.07,13.02 LOAD_CONNECTORS.5
DL2
  Bottom 1.27: Q10.D 79.46,24.53 78.42,23.49 78.42,18.57 74.29,14.45 LOAD_CONNECTORS.6
DP1
  Bottom 1.27: LOAD_CONNECTORS.7 76.84,13.81 79.22,16.19 81.28,16.19 84.5,19.41 D1.A 84.5,22.05 86.58,24.13 88.26,24.13 Q4.D
DP2
  Bottom 1.27: Q5.D 92.71,24.13 D6.A 91.44,16.99 90.01,15.56 84.3,15.56 81.44,12.7 LOAD_CONNECTORS.8
DROPPER_1  (via drill 0.8 pad 1.78)
  Top 0.813: v59.69,44.13 63.98,39.85 66.04,39.85 69.85,36.04 75.72,36.04 82.07,29.69 83.19,29.69 86.29,26.58 86.29,20.23 87.47,19.05 88.42,19.05 v88.74,19.37
  Bottom 0.813: 60.17,44.13 v59.69,44.13 54.61,49.21 54.61,51.75 56.36,53.5 R34.1 61.12,53.5 62.39,54.77 62.39,60.01 58.26,64.14 58.26,71.75 60.17,73.66 LOAD_NMOS_JUMPER.14 | Q4.G 88.74,21.43 v88.74,19.37
DROPPER_1_NANO
  Bottom 0.813: U$1.D4 NUC_NANO-CONNECTORS_2.9 68.26,103.5 70.64,101.12 70.64,87.47 68.26,85.09 62.07,85.09 60.8,83.82 60.8,82.07 60.17,81.44 LOAD_NMOS_JUMPER.13 60.17,81.28
DROPPER_2  (via drill 0.8 pad 1.78)
  Top 0.813: v59.85,47.31 66.04,41.12 66.36,41.12 70.01,37.46 75.88,37.46 82.11,31.23 84.18,31.23 86.85,28.56 90.94,28.56 93.05,26.45 93.05,20.3 94.77,18.57 v95.73,18.57
  Bottom 0.813: v59.85,47.31 58.74,47.31 56.67,49.37 56.67,50.64 57.15,51.12 R5.1 61.12,51.12 63.82,53.82 63.82,60.8 60.01,64.61 60.01,70.96 62.71,73.66 LOAD_NMOS_JUMPER.16 | v95.73,18.57 95.73,21.11 Q5.G
DROPPER_2_NANO  (via drill 0.8 pad 1.78)
  Top 0.813: v63.18,82.71 53.66,92.23 v53.66,114.14
  Bottom 0.813: NUC_NANO_CONNECTORS_1.9 U$1.A3 48.26,108.58 53.66,113.98 v53.66,114.14 | LOAD_NMOS_JUMPER.15 62.71,82.23 v63.18,82.71
ESC_1_SIGNAL
  Bottom 0.813: ISOLATION_CIRCUIT.18 101.44,53.53 104.27,56.36 108.27,56.36 109.06,55.56 110.01,55.56 111.44,56.99 FRC.2
ESC_2_SIGNAL
  Bottom 0.813: ISOLATION_CIRCUIT.17 98.9,52.96 103.72,57.78 109.86,57.78 111.44,59.37 112.87,59.37 FRC.4
ESC_3_SIGNAL
  Bottom 0.813: FRC.6 111.76,62.07 108.67,58.98 103.12,58.98 98.9,54.77 97.79,54.77 96.36,53.34 ISOLATION_CIRCUIT.16 96.36,53.5 96.84,53.98
ESC_4_SIGNAL
  Bottom 0.813: FRC.8 112.87,64.77 112.08,64.77 107.63,60.33 102.55,60.33 98.27,56.04 93.5,56.04 91.44,53.98 91.44,52.39 ISOLATION_CIRCUIT.14
ESC_5_SIGNAL
  Bottom 0.813: ISOLATION_CIRCUIT.13 88.74,53.66 92.39,57.31 97.63,57.31 101.92,61.59 107.16,61.59 109.86,64.29 109.86,65.41 111.6,67.15 FRC.10 | 112.24,67.15 FRC.10 | 112.24,67.31 112.87,67.31 FRC.10
ESC_5V
  Bottom 0.813: 88.74,49.05 89.06,49.05 | 89.06,49.05 88.9,49.21 83.19,49.21 81.28,51.12 81.28,54.45 81.91,55.09 85.57,55.09 90.81,60.33 95.57,60.33 99.43,64.18 105.78,64.18 107.31,65.72 107.31,66.36 108.43,67.47 108.43,70.96 | JP3.1 115.25,71.12 115.1,70.96 108.43,70.96 | THRUSTER_ENABLE_JUMPER.1 92.55,45.56 | THRUSTER_ENABLE_JUMPER.1 91.44,46.67 89.06,49.05 | 98.11,39.05 R31.2 95.09,39.05 93.82,40.32 93.82,43.97 | THRUSTER_ENABLE_JUMPER.1 92.55,45.24 93.82,43.97 | 93.82,43.97 THRUSTER_ENABLE_OPTOCOUPLER.4 96.2,44.77 96.84,45.4 103.19,45.4 C6.1 106.52,45.09 7805_ESC.3 108.11,49.85 107.95,49.69 | ISOLATION_CIRCUIT.20 106.52,51.44 107.95,50.01 107.95,49.69 | R39.2 107.63,49.37 107.95,49.69 | ESC_5V_JUMPER.2 108.43,74.93 108.43,70.96
  Bottom 1.27: JP4.1 121.95,57.69 JP2.1 121.92,61.06 JP1.1 121.95,64.42 JP3.1
ESC_6_SIGNAL
  Bottom 0.813: ISOLATION_CIRCUIT.12 86.2,53.5 91.6,58.9 97.16,58.9 101.09,62.83 106.49,62.83 108.59,64.93 108.59,65.88 110.01,67.31 110.01,68.1 110.81,68.9 115.09,68.9 115.57,68.42 FRC.9
ESC_7V
  Bottom 0.813: BUCK_7V_ESC.OUT+ 112.97,40.58 110.81,38.42 7805_ESC.1 104.3,38.42 C5.1
ESC_A4
  Bottom 0.813: U$6.A4 113.98,91.44 119.38,86.04 119.38,79.06 120.65,77.79 120.65,76.2 124.94,71.91 128.91,71.91 131.76,69.06 131.76,65.72 131.76,59.05 127.06,54.35 JP4.3
ESC_A5
  Bottom 0.813: U$6.A5 114.14,88.9 117.95,85.09 117.95,78.26 119.06,77.15 119.06,75.72 124.14,70.64 127.16,70.64 130.33,67.47 130.33,60.42 127.64,57.72 JP2.3
ESC_A6
  Bottom 0.813: U$6.A6 113.98,86.36 116.68,83.66 116.68,77.63 117.63,76.68 117.63,75.09 123.35,69.37 126.05,69.37 128.91,66.52 128.91,61.28 128.4,60.77 127.35,60.77 JP1.3
ESC_A7
  Bottom 0.813: JP3.3 127,66.2 125.09,68.1 122.56,68.1 118.43,72.23 116.36,74.3 116.36,76.04 115.09,77.31 115.09,83.03 114.3,83.82 U$6.A7
ESC_BATTERY_MAIN
  Bottom 0.813: FRC.5 117.59,62.07 118.6,61.06 118.6,51.9 121.92,48.58 121.92,32.7 116.52,27.3 113.03,27.3 | 113.67,27.3 113.03,27.3 | 113.03,27.3 R29.1 110.65,27.15 108.27,27.15 ESC_PMOS.3
ESC_CELL_1
  Bottom 1.016: BATTERY_MONITERING.2 115.09,126.52 115.73,126.52 117.79,128.59 R24.1
ESC_CELL_1_NANO
  Bottom 0.813: 127.64,129.06 R24.2 | 127.64,129.06 R23.2 128.11,126.52 | U$6.A0 112.4,101.44 113.98,101.44 115.57,103.03 115.57,109.06 119.06,112.55 121.6,112.55 124.14,115.09 124.14,127.79 125.41,129.06 127.48,129.06 127.64,129.06
ESC_CELL_2
  Bottom 1.016: R22.1 118.11,124.46 117.63,123.98 114.94,123.98 BATTERY_MONITERING.4
ESC_CELL_2_NANO
  Bottom 0.813: 128.59,122.4 R21.2 R22.2 125.57,124.46 125.57,114.78 122.08,111.28 119.7,111.28 117,108.58 117,102.39 113.67,99.06 U$6.A1
ESC_CELL_3
  Bottom 1.016: R20.1 118.59,120.33 117.63,121.29 BATTERY_MONITERING.6
ESC_CELL_3_NANO
  Bottom 0.813: R20.2 R19.2 130.02,118.27 130.49,117.79 130.49,112.55 128.91,110.97 125.09,110.97 122.87,108.74 120.97,108.74 119.7,107.47 119.7,100.01 113.67,93.98 U$6.A3
ESC_CELL_4
  Bottom 1.016: R18.1 118.75,116.2 116.21,118.75 BATTERY_MONITERING.8
ESC_CELL_4_NANO
  Bottom 0.813: R18.2 R17.2 | 114.14,96.52 U$6.A2 113.98,96.52 118.27,100.81 118.27,107.95 120.33,110.01 122.56,110.01 124.78,112.24 127.32,112.24 127.64,112.55 R17.2 | R17.2 126.84,114.14
ESC_GND
  Bottom 0.813: 116.84,114.3 117,114.14 R17.1 120.97,114.14 122.56,115.73 122.56,118.27 R19.1 120.97,118.27 122.56,119.86 122.56,122.4 R21.1 120.97,122.4 122.56,123.98 122.56,127.16 122.08,127.64 | ISOLATION_CIRCUIT.19 103.98,53.82 105.09,54.93 107.47,54.93 108.59,53.82 108.59,52.23 110.33,50.48 110.49,50.64 | R23.1 120.97,126.52 122.08,127.64 | 116.84,114.3 115.57,114.3 113.51,112.24 111.12,112.24 108.59,109.7 108.59,109.38 108.74,109.54 108.74,108.58 | 109.06,108.74 108.74,108.43 108.74,108.58 | R33.1 108.74,108.58 | 112.71,76.2 U$6.GND(2) 112.4,76.04 114.46,76.04 115.09,75.41 115.09,73.66 121.92,66.83 123.35,66.83 124.46,65.72 JP3.2 | 129.22,49.69 124.46,49.69 124.3,49.69 R32.1 124.62,49.53 | 129.22,49.69 129.22,54.13 133.19,58.1 133.19,70.48 130.65,73.03 130.65,110.97 132.24,112.55 132.24,118.75 129.7,121.29 129.86,121.44 129.86,129.38 128.91,130.33 124.78,130.33 122.08,127.64 | ESC_5V_LED.K 111.44,51.59 110.49,50.64 | 124.49,51.78 124.3,51.59 121.02,51.59 119.84,52.78 119.84,62.41 117.63,64.61 FRC.7 | PMOS_OPTOCOUPLER.3 112.08,30.64 113.35,31.91 113.35,34.29 112.08,35.56 | 112.08,35.56 107.47,35.56 | 107.47,35.56 Q3.E 101.28,41.27 102.71,42.7 103.35,42.7 C6.2 103.5,41.12 | 103.5,41.12 C5.2 | 103.5,41.12 107.95,41.12 | 107.95,41.12 7805_ESC.2 | 107.95,41.12 108.9,41.12 110.49,42.7 110.49,50.64 | 129.22,49.69 129.22,45.53 BUCK_7V_ESC.OUT- 131.13,45.53 131.13,6.79 BUCK_7V_ESC.IN- 118.14,5.91 114.62,2.38 112.08,2.38 110.81,3.65 110.81,16.35 108.27,18.89 105.89,18.89 103.35,21.43 103.35,27.62 105.57,29.84 105.57,33.66 107.47,35.56 | 112.08,35.56 112.24,35.56
  Bottom 0.813: BATTERY_MONITERING.10 116.84,114.3
  Bottom 1.27: JP3.2 124.46,61.12 JP1.2 124.65,60.93 124.65,57.18 124.62,57.15 124.46,57.31 JP2.2 124.62,57.57 124.62,53.82 124.49,53.94 JP4.2 124.49,52.26 | 124.49,52.26 R4.1 124.46,51.28 124.46,49.69 | 124.49,52.26 124.49,51.78
ESC_PMOS
  Bottom 0.813: R29.2 110.17,19.68 108.27,21.59 ESC_PMOS.1 106.04,21.59 105.25,22.38 105.25,27.78 107.63,30.16 107.63,32.07 108.74,33.18 PMOS_OPTOCOUPLER.4
ESC_POWER
  Bottom 0.813: ESC_PMOS.2 110.81,24.13 112.97,21.97 BUCK_7V_ESC.IN+
FL1
  Bottom 1.27: LOAD_CONNECTORS.3 66.68,14.45 61.28,19.84 61.28,23.81 61.91,24.45 63.98,24.45 Q11.D
FL2
  Bottom 1.27: Q12.D 67.47,24.77 66.68,23.97 66.68,20 69.06,17.62 69.06,12.86 LOAD_CONNECTORS.4
FOCUSSED_1  (via drill 0.8 pad 1.78)
  Top 0.813: v64.77,19.53 63.98,19.53 61.75,21.75 61.75,30.16 60.8,31.12 56.2,31.12 44.5,42.81 43.82,43.5 v43.82,44.13
  Bottom 0.813: R37.1 41.27,61.75 40.8,62.23 40.8,67.15 45.72,72.07 47.62,72.07 50.01,74.45 LOAD_NMOS_JUMPER.6 | R37.1 43.5,61.44 | R37.1 44.45,61.75 46.83,59.37 46.83,55.25 45.09,53.5 43.5,53.5 42.39,52.39 42.39,45.4 43.82,43.97 v43.82,44.13 | Q11.G 64.93,21.27 64.93,19.68 v64.77,19.53
FOCUSSED_2  (via drill 0.8 pad 1.78)
  Top 0.813: v45.56,45.88 45.56,44.93 45.56,44.45 52.86,37.15 55.88,37.15 60.32,32.7 61.12,32.7 62.71,31.12 66.68,31.12 67.94,29.84 67.94,21.91 70.33,19.53 v70.64,19.53
  Bottom 0.813: LOAD_NMOS_JUMPER.8 52.55,74.3 48.9,70.64 46.35,70.64 42.39,66.67 42.39,64.77 R38.1 44.77,63.98 48.42,60.33 48.42,54.45 46.04,52.07 44.45,52.07 43.97,51.59 43.97,47.47 v45.56,45.88 | v70.64,19.53 70.8,19.68 70.8,21.59 Q12.G
FOCUSSED_LIGHT_1_NANO
  Bottom 0.813: U$1.D8 62.23,113.67 | U$1.D8 61.44,113.67 | U$1.D8 NUC_NANO-CONNECTORS_2.5 | U$1.D8 62.07,114.14 60.96,114.14 60.01,113.19 60.01,112.24 54.45,106.68 54.45,84.3 53.66,83.5 52.71,83.5 50.01,80.8 LOAD_NMOS_JUMPER.5 50.01,80.96
FOCUSSED_LIGHT_2_NANO
  Bottom 0.813: U$1.D7 61.44,111.12 | U$1.D7 61.12,111.12 55.88,105.89 55.88,83.66 54.45,82.23 53.66,82.23 52.55,81.12 LOAD_NMOS_JUMPER.7 52.55,80.33 | U$1.D7 NUC_NANO-CONNECTORS_2.6
GRABBER_1_CONTROL_1_NANO  (via drill 0.8 pad 1.78)
  Top 0.813: v68.9,88.9 68.9,87.15 68.9,86.36 69.53,85.72 v69.53,71.75
  Bottom 0.813: 67.47,98.42 NUC_NANO-CONNECTORS_2.11 | U$1.D2 67.47,98.42 | 67.47,98.42 67.63,98.27 67.63,98.11 68.9,96.84 v68.9,88.9 | L298_JUMPER_1.2 68.58,77.79 69.53,76.83 v69.53,71.75
GRABBER_1_CONTROL_2_NANO  (via drill 0.8 pad 1.78)
  Top 0.813: v72.39,96.68 69.06,100.01 v68.74,100.01
  Bottom 0.813: v68.74,100.01 67.79,100.97 NUC_NANO-CONNECTORS_2.10 U$1.D3 | v72.39,96.68 72.39,86.68 69.53,83.82 69.53,78.9 70.96,77.47 L298_JUMPER_2.2
IN1
  Bottom 0.813: L298_MOTOR_DRIVER.IN1 70.49,59.37 64.77,65.09 64.77,79.22 65.88,80.33 L298_JUMPER_1.3
  Bottom 1.27: L298_MOTOR_DRIVER.IN1 L298_MOTOR_DRIVER.IN1H
IN2
  Bottom 0.813: 72.71,80.01 L298_JUMPER_2.3 73.34,80.01 74.45,78.9 74.45,71.91 76.52,69.85 78.42,69.85 80.47,67.8 80.47,62.22 80.17,61.91 | 80.17,61.91 80.33,62.07 | L298_MOTOR_DRIVER.IN2H 80.17,61.91
  Bottom 1.27: L298_MOTOR_DRIVER.IN2 L298_MOTOR_DRIVER.IN2H
IN3
  Bottom 0.813: L298_JUMPER_1.1 66.68,74.77 66.68,66.99 69.53,64.14 72.23,64.14 L298_MOTOR_DRIVER.IN3
  Bottom 1.27: L298_MOTOR_DRIVER.IN3 L298_MOTOR_DRIVER.IN3H
IN4
  Bottom 0.813: L298_JUMPER_2.1 71.91,67.63 L298_MOTOR_DRIVER.IN4
  Bottom 1.27: L298_MOTOR_DRIVER.IN4 L298_MOTOR_DRIVER.IN4H
IR_RECIEVE  (via drill 0.8 pad 1.78)
  Top 0.813: v73.82,111.28 73.82,111.92 69.37,116.36 69.37,121.13 v68.74,121.13
  Bottom 0.813: U$1.D11 NUC_NANO-CONNECTORS_2.2 66.36,121.13 v68.74,121.13 | v73.82,111.28 74.93,112.39 74.93,113.51 IR_RECIEVER.1
N$1
  Bottom 0.813: NUC_NANO_CONNECTORS_1.1 U$1.VIN
N$2
  Bottom 0.813: NANO_NUC_LED.K 41.12,128.9 R6.2
N$4
  Bottom 0.813: R31.1 90.01,36.83 THRUSTER_ENABLE_LED.A
N$5
  Bottom 0.813: ESC_5V_LED.A 113.98,50.01 R39.1
N$6
  Bottom 0.813: SERVO_JUMPER.12 87.31,108.9 U$4.1
  Bottom 1.016: U$4.1 87.31,108.58
N$7
  Bottom 0.813: NUC_NANO_CONNECTORS_1.3 U$1.RST(2)
N$8
  Bottom 0.813: 100.65,30.48 100.81,30.64 PMOS_OPTOCOUPLER.2 | 100.65,30.48 99.85,30.48 | 100.17,30.48 100.65,30.48 | 100.65,30.48 99.38,30.48 97.16,32.7 90.65,32.7 88.74,34.61 88.74,36.99 85.88,39.85 85.09,39.85 83.34,41.59 330Ω.1
N$9
  Bottom 0.813: SERVO_JUMPER.10 85.72,103.82 85.88,103.66 U$4.3
N$10  (via drill 0.8 pad 1.78)
  Top 0.813: v121.13,88.42 120.49,89.06 120.49,105.09 114.14,111.44 95.57,111.44 v93.98,109.86
  Bottom 0.813: v121.13,88.42 123.19,86.36 U$6.D3 | ESC_EMITTER_LED.A 89.38,115.57 93.98,110.97 v93.98,109.86
N$11
  Bottom 0.813: SERVO_JUMPER.8 85.09,98.74 85.25,98.58 U$4.5
N$13
  Bottom 0.813: SERVO_JUMPER.5 84.14,91.12 84.3,90.96 U$4.7
N$14
  Bottom 0.813: 87.47,41.43 THRUSTER_ENABLE_OPTOCOUPLER.2 87.31,41.43 85.72,43.02 R30.1
N$15
  Bottom 0.813: SERVO_JUMPER.3 87.31,86.04 U$4.9
N$16
  Bottom 0.813: THRUSTER_ENABLE_LED.K Q3.C
N$17
  Bottom 0.813: NUC_NANO_CONNECTORS_1.13 U$1.AREF
N$18
  Bottom 0.813: R33.2 99.38,108.11 90.17,117.32 85.25,117.32 ESC_EMITTER_LED.K
N$19
  Bottom 0.813: SERVO_JUMPER.1 87.31,80.96 U$4.11
N$20
  Bottom 0.813: U$1.D1/TX NUC_NANO-CONNECTORS_2.15
N$21
  Bottom 0.813: U$1.D0/RX NUC_NANO-CONNECTORS_2.14
N$22
  Bottom 0.813: U$1.RST(1) NUC_NANO-CONNECTORS_2.13
N$23
  Bottom 0.813: NUC_NANO-CONNECTORS_2.12 62.07,95.89 | 61.91,96.04 62.07,95.89 | 62.07,95.89 U$1.GND(1)
N$34
  Bottom 0.813: NUC_PMOS.1 33.81,118.43 R1.1 36.35,116.2 R2.2
N$38
  Bottom 0.813: R3.2 26.19,94.77 26.19,92.71 26.19,92.08 NUC_5V_LED.K
NANO_5V
  Bottom 0.813: NANO_5V_JUMPER.1 38.5,93.58 38.73,93.82 40.8,95.89 NUC_NANO_CONNECTORS_1.4 | 42.86,95.57 NUC_NANO_CONNECTORS_1.4 | NUC_NANO_CONNECTORS_1.4 U$1.+5V
NANO_ESC_5V
  Bottom 0.813: ESC_5V_JUMPER.1 106.04,78.58 108.74,81.28 U$6.+5V
NUC_3V3
  Bottom 0.813: U$1.3V3 NUC_NANO_CONNECTORS_1.14 41.27,121.29 40.01,120.02 40.01,109.22 38.1,107.31 35.88,107.31 33.5,104.93 DEPTH_SENSOR.2
NUC_5V
  Bottom 0.813: 38.89,78.42 SCHOTKKY_DIODE.A | 106.2,71.44 106.2,70.33 ISOLATION_CIRCUIT.1 | 80.65,49.21 80.65,49.53 79.85,50.32 79.85,55.09 81.44,56.67 85.09,56.67 90.33,61.91 95.25,61.91 98.88,65.54 105.39,65.54 105.89,66.04 105.89,66.83 106.52,67.47 ISOLATION_CIRCUIT.1 | IR_RECIEVER.2 76.52,116.2 79.06,113.67 88.9,113.67 91.76,110.81 91.76,108.74 97.31,103.19 97.31,98.27 101.76,93.82 101.76,76.68 102.87,75.56 102.87,73.66 103.5,73.03 105.09,73.03 106.52,71.6 ISOLATION_CIRCUIT.1 | ISOLATION_CIRCUIT.1 106.36,69.85 | 80.65,49.21 81.12,49.21 81.6,48.74 81.6,41.27 84.77,38.1 85.72,38.1 87.47,36.35 87.47,33.81 90.01,31.27 96.2,31.27 98.43,29.05 101.92,29.05 | 80.65,49.21 69.37,49.21 67.47,47.31 67.47,43.66 64.61,40.8 64.61,40.64 38.26,40.64 33.97,44.93 33.97,53.98 30.48,57.47 30.48,75.25 C4.1 | PMOS_OPTOCOUPLER.1 102.87,33.18 103.82,32.23 103.82,29.84 103.03,29.05 101.92,29.05 | NUC_5V_JUMPER.3 NUC_5V_JUMPER.2 108.11,9.37 | 107.79,15.24 NUC_5V_JUMPER.4 | 101.6,28.73 101.92,29.05 | NUC_5V_LED.A 33.18,90.65 R7.1 33.81,90.96 33.81,79.69
  Bottom 1.27: C4.1 30.48,78.42 31.43,79.38 7805_NUC.3 33.81,79.69 36.67,79.69 SCHOTKKY_DIODE.A | 101.6,28.73 101.6,20.32 104.62,17.3 106.68,17.3 108.11,15.88 NUC_5V_JUMPER.4 NUC_5V_JUMPER.3 108.11,9.37 NUC_5V_JUMPER.1 107.63,6.83 107.63,9.37 NUC_5V_JUMPER.2
NUC_6V
  Bottom 0.813: 91.44,12.54 D6.C
  Bottom 1.27: 76.99,8.89 LOAD_POWER_PINS.2 LOAD_POWER_PINS.1 81.82,9.05 D1.C 85.47,12.7 D6.C 91.76,13.02 7806_NUC.3 97.79,14.61 C2.1
NUC_7V
  Bottom 0.813: 7805_NUC.1 31.31,84.64
  Bottom 1.27: BUCK_7V_NUC.OUT+ 22.77,82.61 26.03,85.88 C3.1 30.32,85.88 7805_NUC.1
NUC_12V
  Bottom 0.813: 43.15,28.58 BUCK_12_NUC.OUT+ | 7806_NUC.1 97,7.14 C1.1
  Bottom 1.27: BUCK_12_NUC.OUT+ 43.15,21.46 49.85,14.76 51.59,14.76 56.2,10.16 58.42,10.16 59.53,9.05 LOAD_POWER_PINS.8 | 60.32,9.05 LOAD_POWER_PINS.8 | LOAD_POWER_PINS.8 LOAD_POWER_PINS.7 | L298_MOTOR_DRIVER.12VH L298_MOTOR_DRIVER.12V 69.69,41.49 69.69,39.21 64.93,34.45 D7.C 47.31,34.45 D8.C 45.78,34.13 43.15,31.5 BUCK_12_NUC.OUT+ | 91.12,8.41 90.65,8.41 91.12,7.94 7806_NUC.1 | NUC_12V_JUMPER.1 NUC_12V_JUMPER.2 NUC_12V_JUMPER.3 NUC_12V_JUMPER.4 | 91.12,8.41 90.81,8.73 90.81,9.21 86.2,9.21 83.19,6.19 69.22,6.19 66.99,3.97 58.26,3.97 55.88,6.35 54.13,6.35 49.85,10.64 47.31,10.64 30.32,27.62 24.29,27.62 22.86,29.05 22.86,33.34 24.77,35.24 30.64,35.24 39.37,26.51 43.05,26.51 BUCK_12_NUC.OUT+ | NUC_12V_JUMPER.4 89.69,7.78 86.52,7.78 86.52,7.94 86.84,8.25 86.84,8.57 88.26,8.57 88.42,8.41 90.01,8.41 90.49,7.94 90.49,7.78 | NUC_12V_JUMPER.4 90.96,8.25 91.12,8.41
NUC_24V
  Bottom 1.27: LOAD_POWER_PINS.3 LOAD_POWER_PINS.4 71.44,9.37 69.53,9.37 LOAD_POWER_PINS.5 LOAD_POWER_PINS.6 66.68,7.14 65.88,6.35 59.37,6.35 57.47,8.25 55.24,8.25 50.8,12.7 48.74,12.7 40.64,20.8 30,31.43 26.42,31.43 BOOST_24V_NUC.OUT+ 26.37,31.42
NUC_BATTERY_MAIN
  Bottom 0.813: NUC_PMOS.3 30.96,123.83
  Bottom 1.27: R1.2 33.97,123.98 33.5,123.51 NUC_PMOS.3 25.24,123.51 23.02,121.29 18.41,121.29 J1.+
NUC_CELL_1
  Bottom 0.813: 108.11,116.05 R9.1 108.59,116.05 111.28,118.75 BATTERY_MONITERING.7
NUC_CELL_1_NANO
  Bottom 0.813: NUC_NANO_CONNECTORS_1.6 U$1.A6 49.05,100.97 50.16,102.08 50.16,108.27 55.4,113.51 55.4,120.33 60.88,125.81 73.1,125.81 76.99,121.92 90.96,121.92 96.84,116.05 R9.2 R10.2
NUC_CELL_2
  Bottom 0.813: BATTERY_MONITERING.5 111.76,120.65 107.63,120.65 R11.1
NUC_CELL_2_NANO
  Bottom 0.813: NUC_NANO_CONNECTORS_1.10 U$1.A2 48.26,111.12 53.66,116.52 53.66,120.49 60.32,127.16 73.66,127.16 77.47,123.35 91.44,123.35 94.46,120.33 R11.2 99.69,118.27 R12.2
NUC_CELL_3
  Bottom 0.813: R13.1 111.6,124.62 BATTERY_MONITERING.3
NUC_CELL_3_NANO
  Bottom 0.813: NUC_NANO_CONNECTORS_1.11 U$1.A1 48.26,113.67 52.23,117.63 52.23,121.13 59.69,128.59 74.29,128.59 78.1,124.78 92.07,124.78 94.46,122.4 R14.2 R13.2 99.69,123.83 98.9,123.03
NUC_CELL_4
  Bottom 0.813: R15.1 109.22,129.06 111.92,126.36 BATTERY_MONITERING.1
NUC_CELL_4_NANO
  Bottom 0.813: NUC_NANO_CONNECTORS_1.12 U$1.A0 48.74,116.2 50.48,117.95 50.48,121.6 58.9,130.02 75.09,130.02 78.58,126.52 92.55,126.52 93.19,125.89 97,125.89 97.95,126.84 R16.2 | R16.2 R15.2 | 99.06,126.84 R16.2
NUC_GND
  Bottom 0.813: R16.1 105.41,126.84 104.46,125.89 104.46,123.67 105.73,122.4 R14.1 105.89,122.4 104.46,120.97 104.62,120.81 104.62,118.9 105.41,118.11 | 105.41,118.11 R12.1 | 105.41,118.11 104.78,117.47 104.78,114.3 106.2,112.87 R10.1 109.38,113.82 111.76,116.2 BATTERY_MONITERING.9 | NUC_NANO_CONNECTORS_1.2 U$1.GND(2) | 47.94,90.65 47.78,90.8 U$1.GND(2) | J1.- 5.49,121.34 BUCK_7V_NUC.IN- | 31.27,82.39 7805_NUC.2 | U$1.GND(2) 49.69,90.8 50.01,90.49 50.01,87 48.58,85.57 | 46.2,85.57 43.34,85.57 | 48.58,85.57 46.2,85.57 | 46.2,85.57 46.35,85.41 48.42,85.41 48.58,85.57
  pour Bottom (isolate 0.813): -66.2,169.39 -66.2,-29.37 -64.13,-29.37 157.16,-29.37 157.16,190.82 -66.2,190.82
NUC_NANO_D13
  Bottom 0.813: 48.42,123.83 U$1.D13 NUC_NANO_CONNECTORS_1.15 40.48,123.83 39.85,124.46 NANO_NUC_LED.A
NUC_POWER
  Bottom 1.27: NUC_PMOS.2 27.88,120.97 BUCK_7V_NUC.IN+ 20.86,115.86 17.46,112.46 17.46,72.71 19.53,70.64 | BUCK_12_NUC.IN+ 3.59,26.35 4.57,26.35 11.11,26.35 19.53,34.77 19.53,70.64 | BOOST_24V_NUC.IN+ 25.65,70.33 21.11,70.33 21.11,70.01 21.11,69.85 21.11,69.06 20.64,69.53 19.53,70.64
REED_1  (via drill 0.8 pad 1.78)
  Top 0.813: v28.58,107 28.58,101.76 30.48,99.85 v30.48,98.74
  Bottom 0.813: 42.55,98.42 NUC_NANO_CONNECTORS_1.5 | REED_SWITCH.3 28.58,109.06 v28.58,107 | U$1.A7 47.15,98.58 43.34,98.58 NUC_NANO_CONNECTORS_1.5 | NUC_NANO_CONNECTORS_1.5 42.23,98.42 | NUC_NANO_CONNECTORS_1.5 42.86,98.74 R7.2 33.5,98.9 30.64,98.9 v30.48,98.74
REED_2
  Bottom 0.813: R2.1 31.75,114.62 32.86,113.51 REED_SWITCH.2
SERVO_1
  Bottom 0.813: SERVO_JUMPER.13 87.31,111.44 U$4.0 87.63,111.12 89.06,111.12 90.33,109.86 90.33,107.47 95.41,102.39 95.41,97.47 99.85,93.03 99.85,76.52 101.44,74.93 101.44,71.75 ISOLATION_CIRCUIT.3
SERVO_2
  Bottom 0.813: 87.63,106.36 U$4.2 | SERVO_JUMPER.11 87.31,106.36 U$4.2 | U$4.2 88.58,106.2 93.5,101.28 93.5,96.36 97.95,91.92 97.95,75.88 99.38,74.45 99.38,70.48 ISOLATION_CIRCUIT.4
SERVO_3
  Bottom 0.813: SERVO_JUMPER.9 81.6,101.28 87.31,101.28 U$4.4 89.69,101.12 91.6,99.22 91.6,94.93 95.88,90.65 95.88,70.48 ISOLATION_CIRCUIT.5
SERVO_4
  Bottom 0.813: SERVO_JUMPER.6 87.31,93.66 U$4.6 88.42,93.5 93.98,87.95 93.98,76.83 90.49,73.34 89.38,73.34 88.58,72.55 88.58,70.17 ISOLATION_CIRCUIT.8
SERVO_5
  Bottom 0.813: SERVO_JUMPER.4 87.31,88.58 U$4.8 89.69,88.42 92.07,86.04 92.07,77.31 89.69,74.93 87.47,74.93 85.88,73.34 85.88,70.33 ISOLATION_CIRCUIT.9
SERVO_6
  Bottom 0.813: SERVO_JUMPER.2 87.31,83.5 U$4.10 89.22,83.34 90.49,82.07 90.49,77.79 89.06,76.36 86.36,76.36 83.66,73.66 ISOLATION_CIRCUIT.10
THRUSTER_ENABLE  (via drill 0.35, 0.8 pad 1.78)
  Top 0.813: v69.37,123.98 69.53,123.98 70.64,122.87 70.64,104.46 74.29,100.81 74.29,80.49 81.76,73.03 81.76,49.53 85.09,46.2 v86.2,46.2
  Bottom 0.813: NUC_NANO-CONNECTORS_2.1 69.22,123.83 v69.37,123.98 | THRUSTER_ENABLE_OPTOCOUPLER.1 88.42,43.97 v86.2,46.2
  Bottom 1.27: U$1.D12 NUC_NANO-CONNECTORS_2.1
THRUSTER_ENABLE_ESC  (via drill 0.35)
  Top 0.813: v116.52,47.94 100.65,47.94 v100.33,48.26 | v99.69,43.02 99.69,46.35 98.27,47.78 v98.27,47.94
  Bottom 0.813: 93.82,51.28 ISOLATION_CIRCUIT.15 93.82,49.53 95.09,48.26 95.09,48.1 | 95.09,47.62 95.25,47.78 | 116.36,49.69 R4.2 116.36,56.2 FRC.1 | 116.36,49.69 R32.2 | 95.09,47.62 95.09,48.1 | Q3.B 98.74,36.83 98.9,36.83 99.69,37.62 99.69,41.59 99.38,41.91 | v116.52,47.94 116.36,48.1 116.36,49.69 | THRUSTER_ENABLE_OPTOCOUPLER.3 96.68,41.91 99.38,41.91 | 95.09,48.1 95.25,47.94 v98.27,47.94 100.01,47.94 v100.33,48.26 | THRUSTER_ENABLE_JUMPER.2 95.09,47.62 | v99.69,43.02 99.69,42.23 99.38,41.91
TORPEDO_1  (via drill 0.8 pad 1.78)
  Top 0.813: v51.59,20.16 49.37,22.38 49.37,31.91 38.42,42.86 38.42,46.2 v39.05,46.83
  Bottom 0.813: R27.1 40.32,57.31 37.78,59.85 37.78,67.94 42.55,72.71 44.93,75.09 LOAD_NMOS_JUMPER.2 | R27.1 43.66,57.31 | v39.05,46.83 39.05,53.5 42.7,57.15 R27.1 | Q9.G 52.55,22.07 52.55,20.16 v51.59,20.16
TORPEDO_1_NANO
  Bottom 0.813: U$1.D10 61.28,118.75 | U$1.D10 61.44,118.75 | U$1.D10 60.8,118.75 57.31,115.25 57.31,113.51 51.59,107.79 51.59,86.52 49.05,83.98 46.99,83.98 44.93,81.92 LOAD_NMOS_JUMPER.1 | U$1.D10 NUC_NANO-CONNECTORS_2.3 67.47,118.75
TORPEDO_2  (via drill 0.8 pad 1.78)
  Top 0.813: v58.9,20 58.23,20 56.54,21.69 56.54,28.55 53.98,31.12 52.86,31.12 40.8,43.18 v40.8,44.29
  Bottom 0.813: R26.1 43.02,59.37 40.8,59.37 39.21,60.96 39.21,67.47 45.09,73.34 46.67,73.34 47.78,74.45 47.78,76.36 LOAD_NMOS_JUMPER.4 | R26.1 43.5,59.21 | R26.1 43.97,59.53 | R26.1 44.45,59.53 45.4,58.58 45.4,56.36 44.13,55.09 42.7,55.09 40.8,53.18 v40.8,44.29 | v58.9,20 59.21,20.32 59.21,21.91 Q7.G
TORPEDO_2_NANO
  Bottom 0.813: U$1.D9 62.39,116.2 | 61.6,116.2 U$1.D9 | U$1.D9 NUC_NANO-CONNECTORS_2.4 | U$1.D9 60.48,116.2 58.74,114.46 58.74,113.19 53.02,107.47 53.02,85.72 50.01,82.71 47.94,82.71 46.99,81.76 46.99,79.69 LOAD_NMOS_JUMPER.3
TP1
  Bottom 0.813: 61.6,13.18 LOAD_CONNECTORS.1
  Bottom 1.27: LOAD_CONNECTORS.1 61.44,12.86 56.99,12.86 52.86,16.99 50.96,16.99 46.99,20.95 D8.A 48.42,25.4 Q9.D
TP2
  Bottom 1.27: LOAD_CONNECTORS.2 64.13,13.97 62.07,16.03 58.26,16.03 54.93,19.37 D7.A 58.1,24.29 Q7.D
(copper drawn outside any net)
  shapes: Top area x2